# EAGLE design Tiny_UniProg (EAGLE 9.5.2)

## Sheet 1 of 2
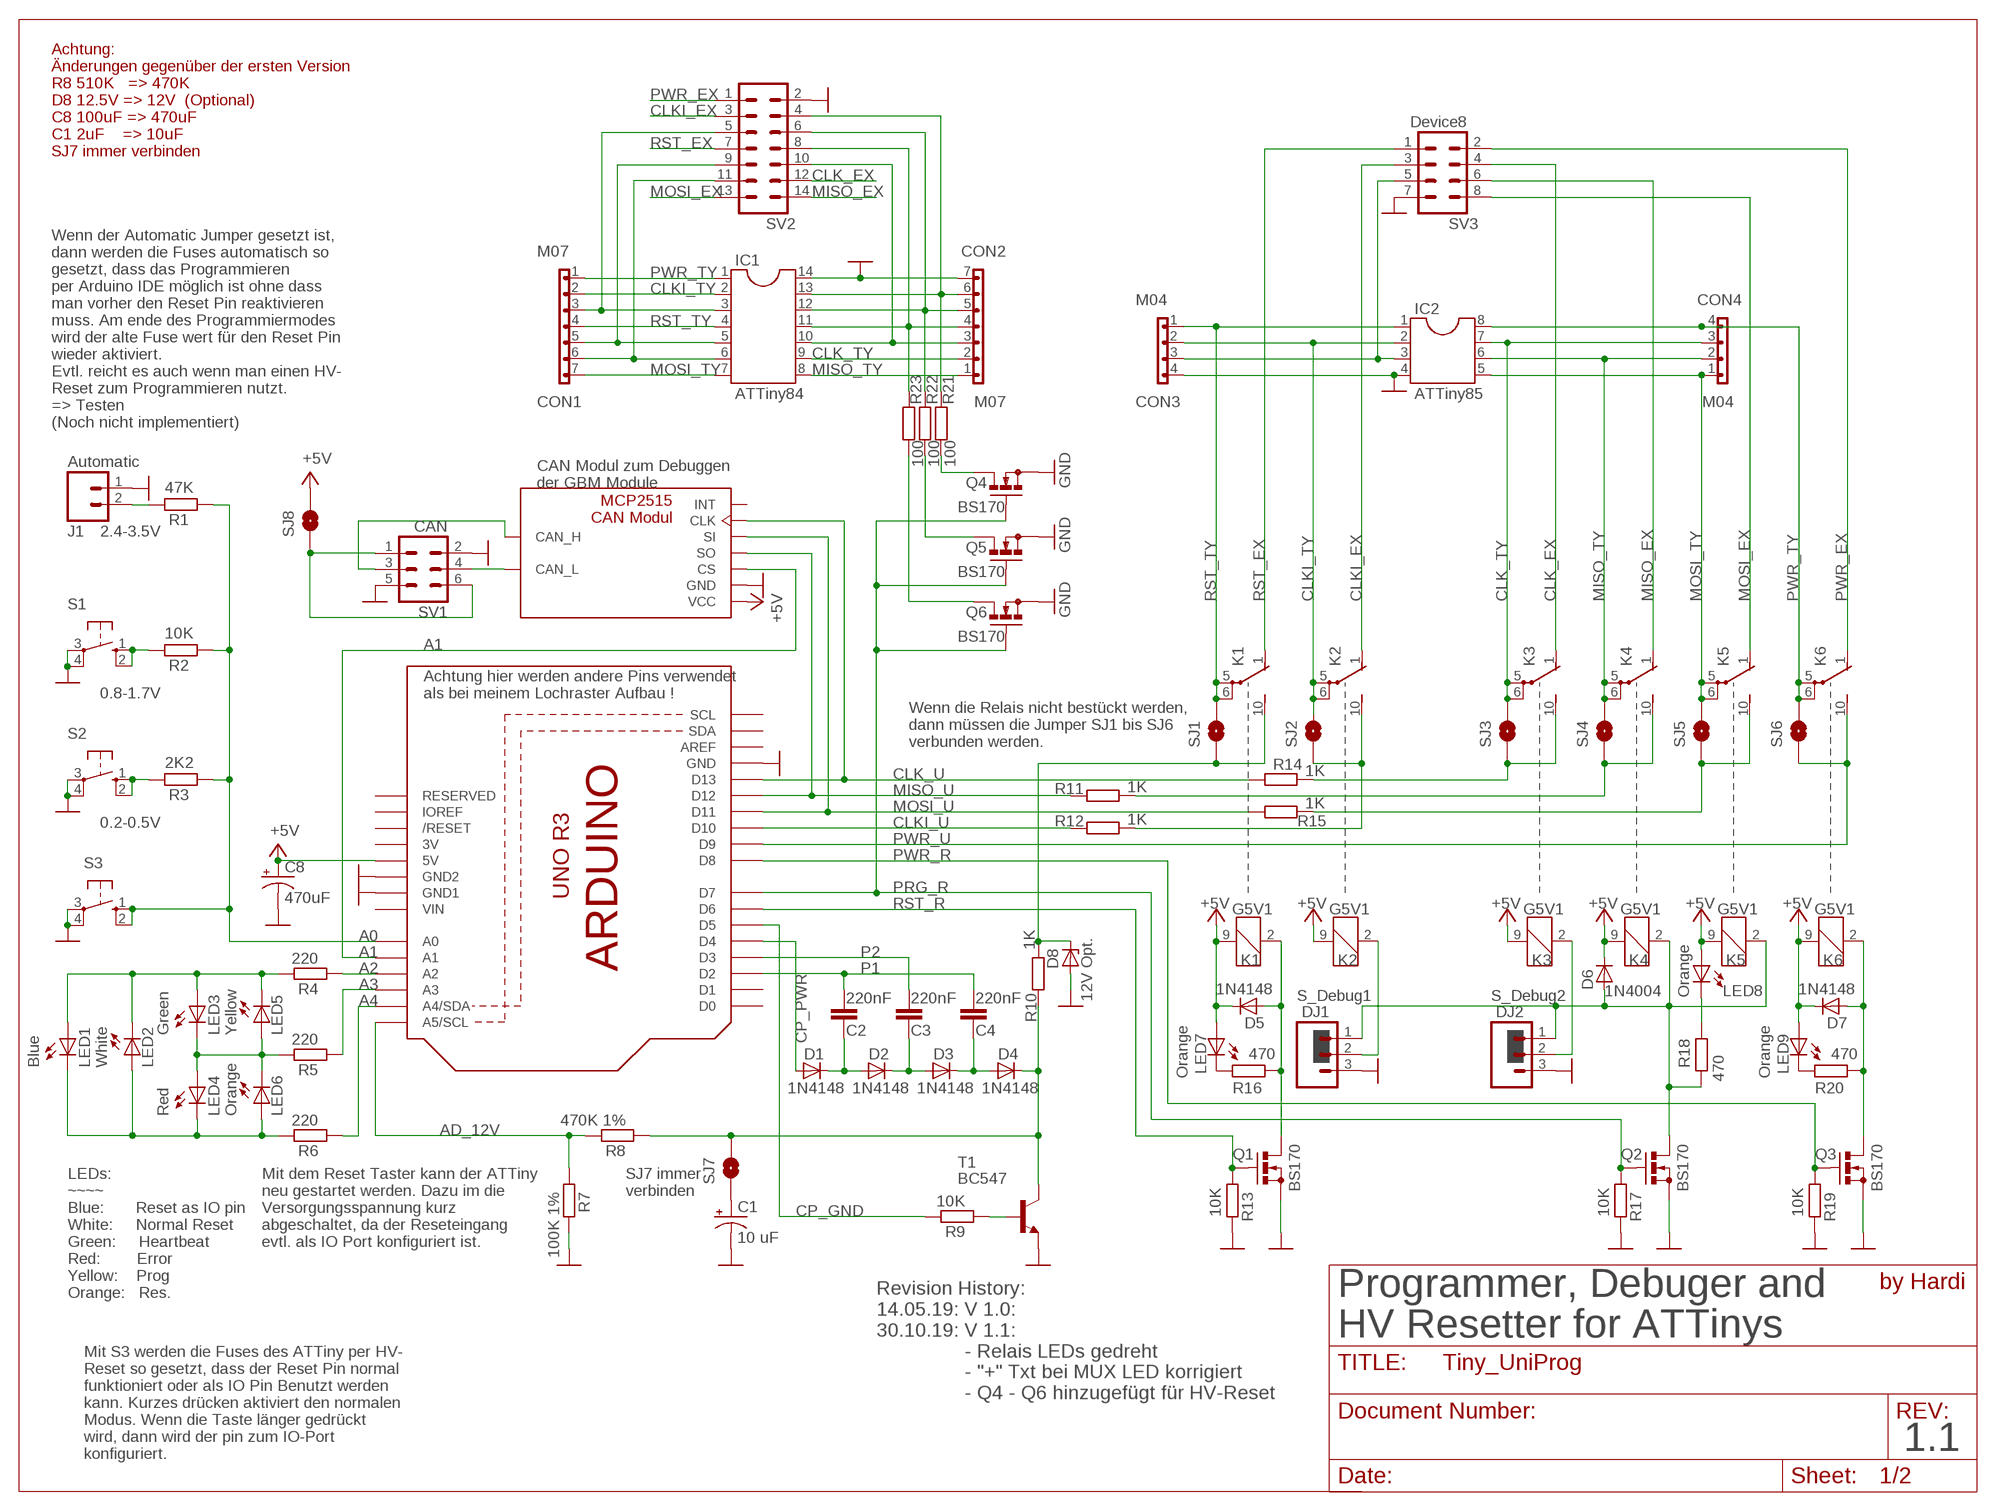
[diagram p0: schematic, sheet 1]

### Parts
C1  10 uF  100UF-25V-20%(PTH)D5MM  [CPOL-RADIAL-10UF-63V]
C2  220nF  C-EU050-024X044  [C050-024X044]
C3  220nF  C-EU050-024X044  [C050-024X044]
C4  220nF  C-EU050-024X044  [C050-024X044]
C8  470uF  SPARKFUN-CAPACITORS_100UF-25V-20%(PTH)  [SPARKFUN-CAPACITORS_CPOL-RADIAL-100UF-25V]
CAN1  MCP2515_CAN_MODUL  [MCP2515_CAN_MODUL]
CON1  M07  [1X07]
CON2  M07  [1X07]
CON3  M04  [1X04]
CON4  M04  [1X04]
D1  1N4148  1N4148DO35-2  [DO35-2]
D2  1N4148  1N4148DO35-2  [DO35-2]
D3  1N4148  1N4148DO35-2  [DO35-2]
D4  1N4148  1N4148DO35-2  [DO35-2]
D5  1N4148  1N4148DO35-2  [DO35-2]
D6  1N4004  1N4004DO35-2  [DO35-2]
D7  1N4148  1N4148DO35-2  [DO35-2]
D8  12V Opt.  ZENER-DIODEZD-2.5  [ZDIO-2.5]
DJ1  S_Debug1  M03PTH  [1X03]
DJ2  S_Debug2  M03PTH  [1X03]
IC1  ATTiny84  DIL14  [DIL14]
IC2  ATTiny85  DIL8  [DIL08]
J1  Automatic  M02PTH  [1X02]
K1  G5V1  [G5V1]
K2  G5V1  [G5V1]
K3  G5V1  [G5V1]
K4  G5V1  [G5V1]
K5  G5V1  [G5V1]
K6  G5V1  [G5V1]
LED1  Blue  LED3MM  [LED3MM]
LED2  White  LED3MM  [LED3MM]
LED3  Green  LED3MM  [LED3MM]
LED4  Red  LED3MM  [LED3MM]
LED5  Yellow  LED3MM  [LED3MM]
LED6  Orange  LED3MM  [LED3MM]
LED7  Orange  LED3MM  [LED3MM]
LED8  Orange  LED3MM  [LED3MM]
LED9  Orange  LED3MM  [LED3MM]
Q1  BS170  [SOT54E]
Q2  BS170  [SOT54E]
Q3  BS170  [SOT54E]
Q4  BS170  [SOT54E]
Q5  BS170  [SOT54E]
Q6  BS170  [SOT54E]
R1  47K  R0204/7  [0204/7]
R2  10K  R0204/7  [0204/7]
R3  2K2  R0204/2V  [0204/2V]
R4  220  R0204/2V  [0204/2V]
R5  220  R0204/2V  [0204/2V]
R6  220  R0204/2V  [0204/2V]
R7  100K 1%  R0204/2V  [0204/2V]
R8  470K 1%  R0204/7  [0204/7]
R9  10K  R0204/2V  [0204/2V]
R10  1K  R0204/2V  [0204/2V]
R11  1K  R0204/2V  [0204/2V]
R12  1K  R0204/2V  [0204/2V]
R13  10K  R0204/2V  [0204/2V]
R14  1K  R0204/2V  [0204/2V]
R15  1K  R0204/2V  [0204/2V]
R16  470  R0204/2V  [0204/2V]
R17  10K  R0204/2V  [0204/2V]
R18  470  R0204/2V  [0204/2V]
R19  10K  R0204/2V  [0204/2V]
R20  470  R0204/2V  [0204/2V]
R21  100  R0204/2V  [0204/2V]
R22  100  R0204/2V  [0204/2V]
R23  100  R0204/2V  [0204/2V]
S1  10-XX  [B3F-10XX]
S2  10-XX  [B3F-10XX]
S3  10-XX  [B3F-10XX]
SJ1  SOLDERJUMPERNO  [SJ_2S-NO]
SJ2  SOLDERJUMPERNO  [SJ_2S-NO]
SJ3  SOLDERJUMPERNO  [SJ_2S-NO]
SJ4  SOLDERJUMPERNO  [SJ_2S-NO]
SJ5  SOLDERJUMPERNO  [SJ_2S-NO]
SJ6  SOLDERJUMPERNO  [SJ_2S-NO]
SJ7  SOLDERJUMPERNO  [SJ_2S-NO]
SJ8  SOLDERJUMPERNO  [SJ_2S-NO]
SV1  CAN  ML6  [ML6]
SV2  ML14  [ML14]
SV3  Device8  CON-HARTING-ML_ML08  [CON-HARTING-ML_ML08]
T1  BC547  [TO92]
U1  ARDUINOR3-DIMENSION  [ARDUINOR3]

### Nets
+5V: C8.1(+) CAN1.1(VCC) D5.C D6.C D7.C K1.9 K2.9 K3.9 K4.9 K5.9 K6.9 LED7.A LED8.A LED9.A SJ8.2 U1.5V
A0: R1.1 R2.1 R3.1 S3.1(S) S3.2(S1) U1.A0
A1: CAN1.3(CS) U1.A1
A2: R4.1 U1.A2
A3: R5.1 U1.A3
A4: R6.1 U1.A4(A4/SDA)
AD_12V: R7.1 R8.2 U1.A5(A5/SCL)
CLK_EX: K3.1(2:O) SV2.12 SV3.4
CLK_TY: CON2.2 CON4.3 IC1.9 IC2.7 K3.5(2:P) K3.6(2:P) SJ3.2
CLK_U: CAN1.6(CLK) R14.1 U1.D13
CLKI_EX: K2.1(2:O) SV2.3 SV3.3
CLKI_TY: CON1.2 CON3.2 IC1.2 IC2.2 K2.5(2:P) K2.6(2:P) SJ2.2
CLKI_U: R12.1 U1.D10
CP_GND: R9.2 U1.D5
CP_PWR: D1.A U1.D4
GND: C1.2(-) C8.2(-) CAN1.2(GND) CON2.7 CON3.4 D8.A DJ1.3 DJ2.3 IC1.14 IC2.4 J1.1 Q1.S Q2.S Q3.S Q4.S Q5.S Q6.S R7.2 R13.2 R17.2 R19.2 S1.3(P) S1.4(P1) S2.3(P) S2.4(P1) S3.3(P) S3.4(P1) SV1.2 SV1.5 SV2.2 SV3.7 T1.1(E) U1.GND U1.GND1 U1.GND2
MISO_EX: K4.1(2:O) SV2.14 SV3.6
MISO_TY: CON2.1 CON4.2 IC1.8 IC2.6 K4.5(2:P) K4.6(2:P) SJ4.2
MISO_U: CAN1.4(SO) R11.1 U1.D12
MOSI_EX: K5.1(2:O) SV2.13 SV3.8
MOSI_TY: CON1.7 CON4.1 IC1.7 IC2.5 K5.5(2:P) K5.6(2:P) SJ5.2
MOSI_U: CAN1.5(SI) R15.1 U1.D11
N$1: C2.2 D1.C D2.A
N$2: C3.2 D2.C D3.A
N$3: C4.2 D3.C D4.A
N$6: CON2.3 IC1.10 SV2.10
N$7: R9.1 T1.2(B)
N$8: CAN1.8(CAN_L) SV1.4
N$9: D4.C R8.1 R10.2 SJ7.2 T1.3(C)
N$10: CAN1.9(CAN_H) SV1.3
N$11: CON2.4 IC1.11 R23.2 SV2.8
N$12: CON2.5 IC1.12 R22.2 SV2.6
N$13: K5.10(2:S) R15.2 SJ5.1
N$14: CON2.6 IC1.13 R21.2 SV2.4
N$15: K4.10(2:S) R11.2 SJ4.1
N$17: K3.10(2:S) R14.2 SJ3.1
N$19: DJ1.2 K2.2
N$20: D5.A K1.2 Q1.D R16.2
N$21: DJ2.2 K3.2
N$22: D8.C K1.10(2:S) R10.1 SJ1.1
N$23: CON1.6 IC1.6 SV2.11
N$24: K2.10(2:S) R12.2 SJ2.1
N$25: D7.A K6.2 Q3.D R20.2
N$26: D6.A DJ1.1 DJ2.1 K4.2 K5.2 Q2.D R18.2
N$27: CON1.5 IC1.5 SV2.9
N$28: J1.2 R1.2
N$30: CON1.3 IC1.3 SV2.5
N$33: R3.2 S2.1(S) S2.2(S1)
N$34: LED1.A LED2.K(C) LED3.A LED5.K(C) R4.2
N$36: LED7.K(C) R16.1
N$37: LED8.K(C) R18.1
N$38: LED9.K(C) R20.1
N$39: C1.1(+) SJ7.1
N$42: LED3.K(C) LED4.A LED5.A LED6.K(C) R5.2
N$44: LED1.K(C) LED2.A LED4.K(C) LED6.A R6.2
N$45: SJ8.1 SV1.1 SV1.6
N$48: CON3.3 IC2.3 SV3.5
N$67: R2.2 S1.1(S) S1.2(S1)
N$108: Q4.D R21.1
N$109: Q5.D R22.1
N$110: Q6.D R23.1
P1: C2.1 C4.1 U1.D2
P2: C3.1 U1.D3
PRG_R: Q2.G Q4.G Q5.G Q6.G R17.1 U1.D7
PWR_EX: K6.1(2:O) SV2.1 SV3.2
PWR_R: Q3.G R19.1 U1.D8
PWR_TY: CON1.1 CON4.4 IC1.1 IC2.8 K6.5(2:P) K6.6(2:P) SJ6.2
PWR_U: K6.10(2:S) SJ6.1 U1.D9
RST_EX: K1.1(2:O) SV2.7 SV3.1
RST_R: Q1.G R13.1 U1.D6
RST_TY: CON1.4 CON3.1 IC1.4 IC2.1 K1.5(2:P) K1.6(2:P) SJ1.2
Unconnected: CAN1.7(INT) U1.AREF U1.D0 U1.D1 U1.IOREF U1.RESERVED U1.RESET(/RESET) U1.SCL U1.SDA

### Notes on the sheet
- Achtung:
  Änderungen gegenüber der ersten Version
  R8 510K   => 470K
  D8 12.5V => 12V  (Optional)
  C8 100uF => 470uF
  C1 2uF    => 10uF
  SJ7 immer verbinden
- Wenn der Automatic Jumper gesetzt ist,
  dann werden die Fuses automatisch so
  gesetzt, dass das Programmieren
  per Arduino IDE möglich ist ohne dass
  man vorher den Reset Pin reaktivieren
  muss. Am ende des Programmiermodes
  wird der alte Fuse wert für den Reset Pin
  wieder aktiviert.
  Evtl. reicht es auch wenn man einen HV-
  Reset zum Programmieren nutzt.
  => Testen
  (Noch nicht implementiert)
- CAN Modul zum Debuggen 
  der GBM Module
- 2.4-3.5V
- 0.8-1.7V
- Achtung hier werden andere Pins verwendet
  als bei meinem Lochraster Aufbau !
- Wenn die Relais nicht bestückt werden,
  dann müssen die Jumper SJ1 bis SJ6
  verbunden werden.
- 0.2-0.5V
- LEDs:
  ~~~~
  Blue:       Reset as IO pin
  White:     Normal Reset
  Green:     Heartbeat
  Red:        Error
  Yellow:    Prog
  Orange:   Res.
- Mit dem Reset Taster kann der ATTiny
  neu gestartet werden. Dazu im die
  Versorgungsspannung kurz
  abgeschaltet, da der Reseteingang
  evtl. als IO Port konfiguriert ist.
- SJ7 immer
  verbinden
- Revision History:
  14.05.19: V 1.0: 
  30.10.19: V 1.1: 
                  - Relais LEDs gedreht 
                  - "+" Txt bei MUX LED korrigiert
                  - Q4 - Q6 hinzugefügt für HV-Reset
- by Hardi
- Programmer, Debuger and 
  HV Resetter for ATTinys
- Mit S3 werden die Fuses des ATTiny per HV-
  Reset so gesetzt, dass der Reset Pin normal
  funktioniert oder als IO Pin Benutzt werden
  kann. Kurzes drücken aktiviert den normalen
  Modus. Wenn die Taste länger gedrückt
  wird, dann wird der pin zum IO-Port 
  konfiguriert.
- 1.1

## Sheet 2 of 2
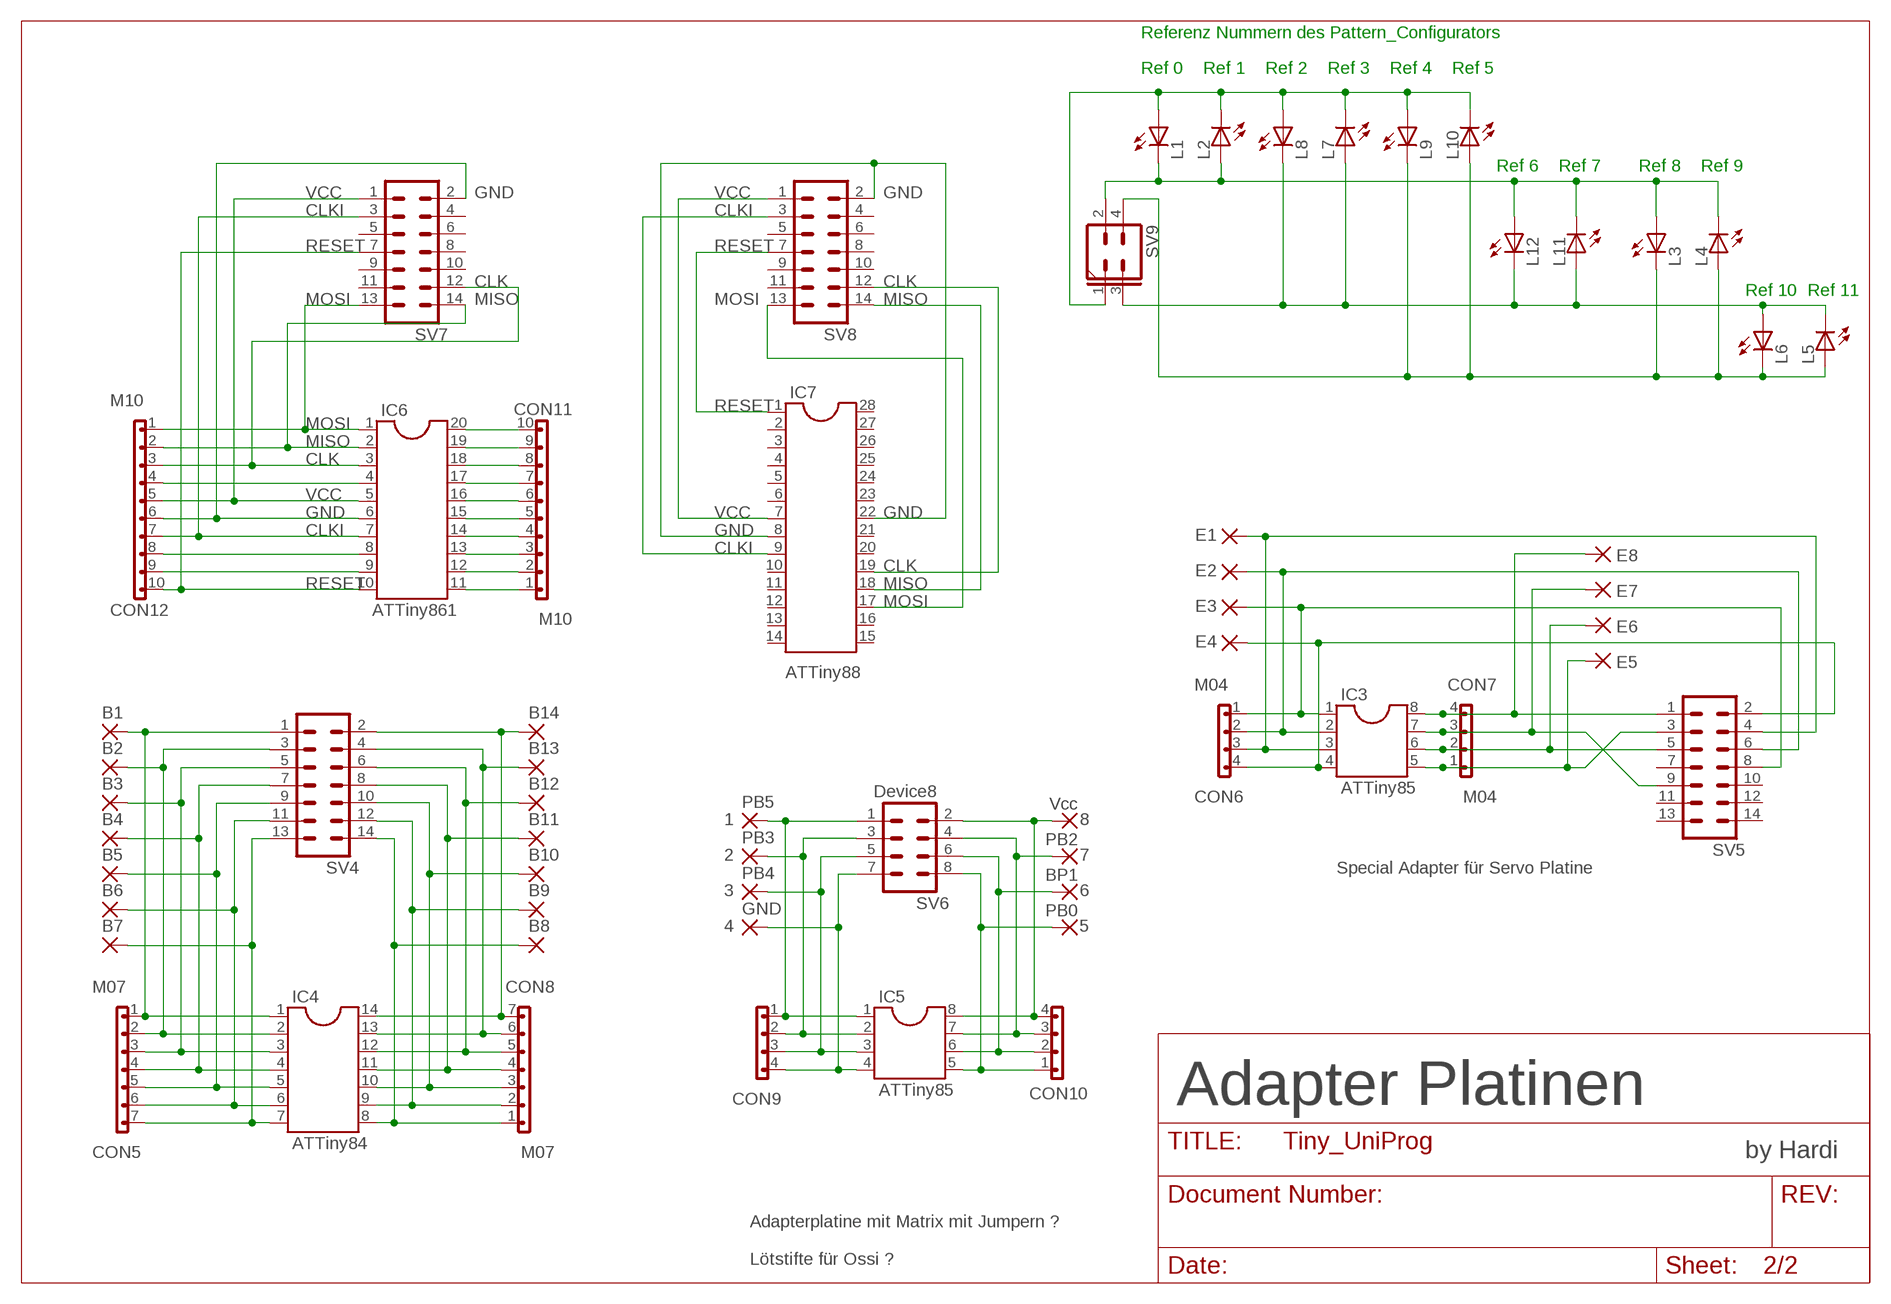
[diagram p1: schematic, sheet 2]

### Parts
1  PB5  2,54/1,0  [2,54/1,0]
2  PB3  2,54/1,0  [2,54/1,0]
3  PB4  2,54/1,0  [2,54/1,0]
4  GND  2,54/1,0  [2,54/1,0]
5  PB0  2,54/1,0  [2,54/1,0]
6  BP1  2,54/1,0  [2,54/1,0]
7  PB2  2,54/1,0  [2,54/1,0]
8  Vcc  2,54/1,0  [2,54/1,0]
B1  2,54/1,0  [2,54/1,0]
B2  2,54/1,0  [2,54/1,0]
B3  2,54/1,0  [2,54/1,0]
B4  2,54/1,0  [2,54/1,0]
B5  2,54/1,0  [2,54/1,0]
B6  2,54/1,0  [2,54/1,0]
B7  2,54/1,0  [2,54/1,0]
B8  2,54/1,0  [2,54/1,0]
B9  2,54/1,0  [2,54/1,0]
B10  2,54/1,0  [2,54/1,0]
B11  2,54/1,0  [2,54/1,0]
B12  2,54/1,0  [2,54/1,0]
B13  2,54/1,0  [2,54/1,0]
B14  2,54/1,0  [2,54/1,0]
CON5  M07  [1X07]
CON6  M04  [1X04]
CON7  M04  [1X04]
CON8  M07  [1X07]
CON9  M04  [1X04]
CON10  M04  [1X04]
CON11  M10  [1X10]
CON12  M10  [1X10]
E1  2,54/1,0  [2,54/1,0]
E2  2,54/1,0  [2,54/1,0]
E3  2,54/1,0  [2,54/1,0]
E4  2,54/1,0  [2,54/1,0]
E5  2,54/1,0  [2,54/1,0]
E6  2,54/1,0  [2,54/1,0]
E7  2,54/1,0  [2,54/1,0]
E8  2,54/1,0  [2,54/1,0]
IC3  ATTiny85  DIL8  [DIL08]
IC4  ATTiny84  DIL14  [DIL14]
IC5  ATTiny85  DIL8  [DIL08]
IC6  ATTiny861  DIL20  [DIL20]
IC7  DIL28-3  [DIL28-3]
L1  LED3MM  [LED3MM]
L2  LED3MM  [LED3MM]
L3  LED3MM  [LED3MM]
L4  LED3MM  [LED3MM]
L5  LED3MM  [LED3MM]
L6  LED3MM  [LED3MM]
L7  LED3MM  [LED3MM]
L8  LED3MM  [LED3MM]
L9  LED3MM  [LED3MM]
L10  LED3MM  [LED3MM]
L11  LED3MM  [LED3MM]
L12  LED3MM  [LED3MM]
SV4  ML14  [ML14]
SV5  ML14  [ML14]
SV6  Device8  CON-HARTING-ML_ML08  [CON-HARTING-ML_ML08]
SV7  ML14  [ML14]
SV8  ML14  [ML14]
SV9  MA02-2MUX-SIGNAL  [MUX-SIGNAL]

### Nets
N$4: 4.1(P) CON9.4 IC5.4 SV6.7
N$5: 3.1(P) CON9.3 IC5.3 SV6.5
N$16: 2.1(P) CON9.2 IC5.2 SV6.3
N$18: 1.1(P) CON9.1 IC5.1 SV6.1
N$29: 5.1(P) CON10.1 IC5.5 SV6.8
N$31: 6.1(P) CON10.2 IC5.6 SV6.6
N$32: 7.1(P) CON10.3 IC5.7 SV6.4
N$35: B8.1(P) CON8.1 IC4.8 SV4.14
N$40: B9.1(P) CON8.2 IC4.9 SV4.12
N$41: B10.1(P) CON8.3 IC4.10 SV4.10
N$43: B11.1(P) CON8.4 IC4.11 SV4.8
N$46: B12.1(P) CON8.5 IC4.12 SV4.6
N$47: B13.1(P) CON8.6 IC4.13 SV4.4
N$49: B14.1(P) CON8.7 IC4.14 SV4.2
N$50: B7.1(P) CON5.7 IC4.7 SV4.13
N$51: B6.1(P) CON5.6 IC4.6 SV4.11
N$52: B5.1(P) CON5.5 IC4.5 SV4.9
N$53: B4.1(P) CON5.4 IC4.4 SV4.7
N$54: B3.1(P) CON5.3 IC4.3 SV4.5
N$55: B2.1(P) CON5.2 IC4.2 SV4.3
N$56: B1.1(P) CON5.1 IC4.1 SV4.1
N$57: 8.1(P) CON10.4 IC5.8 SV6.2
N$58: CON7.4 E8.1(P) IC3.8 SV5.1
N$59: CON6.4 E4.1(P) IC3.4 SV5.2
N$60: CON7.3 E7.1(P) IC3.7 SV5.9
N$61: CON7.2 E6.1(P) IC3.6 SV5.5
N$62: CON7.1 E5.1(P) IC3.5 SV5.3
N$63: CON6.1 E3.1(P) IC3.1 SV5.8
N$64: CON6.2 E2.1(P) IC3.2 SV5.6
N$65: CON6.3 E1.1(P) IC3.3 SV5.4
N$66: CON12.10 IC6.10 SV7.7
N$68: CON12.7 IC6.7 SV7.3
N$69: CON12.6 IC6.6 SV7.2
N$70: CON12.5 IC6.5 SV7.1
N$71: CON12.3 IC6.3 SV7.12
N$72: CON12.2 IC6.2 SV7.14
N$73: CON12.1 IC6.1 SV7.13
N$74: CON12.4 IC6.4
N$75: CON12.8 IC6.8
N$76: CON12.9 IC6.9
N$77: CON11.1 IC6.11
N$78: CON11.2 IC6.12
N$79: CON11.3 IC6.13
N$80: CON11.4 IC6.14
N$81: CON11.5 IC6.15
N$82: CON11.6 IC6.16
N$83: CON11.7 IC6.17
N$84: CON11.8 IC6.18
N$85: CON11.9 IC6.19
N$86: CON11.10 IC6.20
N$87: IC7.9 SV8.3
N$88: IC7.8 IC7.22 SV8.2
N$89: IC7.7 SV8.1
N$90: IC7.1 SV8.7
N$91: IC7.17 SV8.13
N$92: IC7.18 SV8.14
N$93: L1.K(C) L2.A L3.A L4.K(C) L11.K(C) L12.A SV9.2
N$94: IC7.19 SV8.12
N$95: L1.A L2.K(C) L7.K(C) L8.A L9.A L10.K(C) SV9.1
N$97: L3.K(C) L4.A L5.A L6.K(C) L9.K(C) L10.A SV9.4
N$98: L5.K(C) L6.A L7.A L8.K(C) L11.A L12.K(C) SV9.3
Unconnected: IC7.2 IC7.3 IC7.4 IC7.5 IC7.6 IC7.10 IC7.11 IC7.12 IC7.13 IC7.14 IC7.15 IC7.16 IC7.20 IC7.21 IC7.23 IC7.24 IC7.25 IC7.26 IC7.27 IC7.28 SV5.7 SV5.10 SV5.11 SV5.12 SV5.13 SV5.14 SV7.4 SV7.5 SV7.6 SV7.8 SV7.9 SV7.10 SV7.11 SV8.4 SV8.5 SV8.6 SV8.8 SV8.9 SV8.10 SV8.11

### Notes on the sheet
- Referenz Nummern des Pattern_Configurators
- Ref 0 | Ref 1 | Ref 2 | Ref 3 | Ref 4 | Ref 5
- Ref 6 | Ref 7 | Ref 8 | Ref 9
- VCC | GND | VCC | GND
- CLKI | CLKI
- RESET | RESET
- CLK | CLK
- Ref 10 | Ref 11
- MOSI | MISO | MOSI | MISO
- RESET
- MOSI
- MISO
- CLK
- VCC
- GND | VCC | GND
- CLKI | GND
- CLKI
- CLK
- RESET | MISO
- MOSI
- ATTiny88
- Special Adapter für Servo Platine
- Adapter Platinen
- by Hardi
- Adapterplatine mit Matrix mit Jumpern ?
  
  Lötstifte für Ossi ?

## Power pins joined to a net without a drawn wire
3V: U1.3V
VIN: U1.VIN

## Library data of the parts
1-8 B1-B14 E1-E8 = wirepad:2,54/1,0: THROUGH-HOLE PAD
C1 = SparkFun-Capacitors:100UF-25V-20%(PTH): CAP-08439
C2-C4 = rcl:C-EU: CAPACITOR, European symbol; SPICEPREFIX: C
C8 = Sound_MP3-TF-16P_and_WS2811:SPARKFUN-CAPACITORS_100UF-25V-20%(PTH): CAP-08439; PROD_ID: CAP-08439
CAN1 = Arduino_fuer_LEDs_DCC_2_All:MCP2515_CAN_MODUL: MCP2515 CAN Modul
CON1 CON2 CON5 CON8 = Connectors_Inline3_7:M07
CON3 CON4 CON6 CON7 CON9 CON10 = Connectors_Inline3_7:M04
CON11 CON12 = Connectors_Inline3_7:M10
D1-D5 D7 = diode:1N4148: DIODE high speed (Philips)
D6 = diode:1N4004: DIODE general purpose rectifier, 1 A
D8 = diode:ZENER-DIODE: Z-Diode
DJ1 DJ2 = SparkFun-Connectors:M03: Header 3 Standard 3-pin 0.1" header. Use with straight break away headers (SKU : PRT-00116), right angle break away headers (PRT-00553), swiss pins (PRT-00743), machine pins (PRT-00117), and female headers (PRT-00115). Molex polarized connector foot print use with SKU : PRT-08232 with associated crimp pins and housings.
IC1 IC4 = ic-package:DIL14: Dual In Line / Socket
IC2 IC3 IC5 = ic-package:DIL8: Dual In Line / Socket
IC6 = ic-package:DIL20: Dual In Line / Socket
IC7 = ic-package:DIL28: Dual In Line
J1 = SparkFun-Connectors:M02: Standard 2-pin 0.1" header. Use with - straight break away headers ( PRT-00116) - right angle break away headers (PRT-00553) - swiss pins (PRT-00743) - machine pins (PRT-00117) - female headers (PRT-00115) Molex polarized connector foot print use with: PRT-08233 with associated crimp pins and housings. 2.54_SCREWTERM for use with PRT-10571. 3.5mm Screw Terminal footprints for PRT-08084 5mm Screw Terminal footprints for use with PRT-08432
K1-K6 = relay:G5V1: RELAY 1 x switch, 0.5 A/125 V AC, 1 A/24 V DC , Omron; MPN: G5V-1-DC24; OC_FARNELL: 9949593; OC_NEWARK: 36M6377
L1-L12 LED1-LED9 = Arduino_fuer_LEDs_DCC_2:LED: LED OSRAM: - CHIPLED LG R971, LG N971, LY N971, LG Q971, LY Q971, LO R971, LY R971 LH N974, LH R974 LS Q976, LO Q976, LY Q976 LO Q996 - Hyper CHIPLED LW Q18S LB Q993, LB Q99A, LB R99A - SideLED LS A670, LO A670, LY A670, LG A670, LP A670 LB A673, LV A673, LT A673, LW A673 LH A674 LY A675 LS A676, LA A676, LO A676, LY A676, LW A676 LS A679, LY A679, LG A679 - Hyper Micro SIDELED® LS Y876, LA Y876, LO Y876, LY Y876 LT Y87S - SmartLED LW L88C, LW L88S LB L89C, LB L89S, LG L890 LS L89K, LO L89K, LY L89K LS L896, LA L896, LO L896, LY L896 - TOPLED LS T670, LO T670, LY T670, LG T670, LP T670 LSG T670, LSP T670, LSY T670, LOP T670, LYG T670 LG T671, LOG T671, LSG T671 LB T673, LV T673, LT T673, LW T673 LH T674 LS T676, LA T676, LO T676, LY T676, LB T676, LH T676, LSB T676, LW T676 LB T67C, LV T67C, LT T67C, LS T67K, LO T67K, LY T67K, LW E67C LS E67B, LA E67B, LO E67B, LY E67B, LB E67C, LV E67C, LT E67C LW T67C LS T679, LY T679, LG T679 LS T770, LO T770, LY T770, LG T770, LP T770 LB T773, LV T773, LT T773, LW T773 LH T774 LS E675, LA E675, LY E675, LS T675 LS T776, LA T776, LO T776, LY T776, LB T776 LHGB T686 LT T68C, LB T68C - Hyper Mini TOPLED® LB M676 - Mini TOPLED Santana® LG M470 LS M47K, LO M47K, LY M47K Source: http://www.osram.convergy.de LUXEON: - LUMILED® LXK2-PW12-R00, LXK2-PW12-S00, LXK2-PW14-U00, LXK2-PW14-V00 LXK2-PM12-R00, LXK2-PM12-S00, LXK2-PM14-U00 LXK2-PE12-Q00, LXK2-PE12-R00, LXK2-PE12-S00, LXK2-PE14-T00, LXK2-PE14-U00 LXK2-PB12-K00, LXK2-PB12-L00, LXK2-PB12-M00, LXK2-PB14-N00, LXK2-PB14-P00, LXK2-PB14-Q00 LXK2-PR12-L00, LXK2-PR12-M00, LXK2-PR14-Q00, LXK2-PR14-R00 LXK2-PD12-Q00, LXK2-PD12-R00, LXK2-PD12-S00 LXK2-PH12-R00, LXK2-PH12-S00 LXK2-PL12-P00, LXK2-PL12-Q00, LXK2-PL12-R00 Source: www.luxeon.com KINGBRIGHT: KA-3528ASYC Source: www.kingbright.com
Q1-Q6 = transistor-small-signal:BS170: N-CHANNEL MOS FET
R1 R2 R8 = Arduino_fuer_LEDs_DCC_2:R: RESISTOR, European symbol; SPICEMODEL: NONE; SPICEPREFIX: R
R3-R7 R9-R23 = Arduino_fuer_LEDs_DCC_2:R: RESISTOR, European symbol
S1-S3 = switch-omron:10-XX: OMRON SWITCH; MPN: B3F-1000; OC_FARNELL: 176432; OC_NEWARK: 36M3542
SJ1-SJ8 = SparkFun-Retired:SOLDERJUMPER: Solder Jumper Standard SMD solder jumper. Used to automate production. Two varients : Normally Open and Normally Closed are the same, but have different paste layers. NC will have a large amount of paste and should jumper during reflow.
SV1 = Arduino_fuer_LEDs_DCC_2:ML6: HARTING; OC_FARNELL: unknown; OC_NEWARK: unknown
SV2 SV4 SV5 SV7 SV8 = Arduino_fuer_LEDs_DCC_2:ML14: HARTING; OC_FARNELL: unknown; OC_NEWARK: unknown
SV3 SV6 = PushButtonAction_4017_2:CON-HARTING-ML_ML08: Modified by Hardi; OC_FARNELL: unknown; OC_NEWARK: unknown
SV9 = con-lstb:MA02-2: PIN HEADER
T1 = transistor:BC547: NPN TRANSISTOR
U1 = adafruit:ARDUINOR3: This is a new object for the new Arduino R3 - with extra pins that you may want to use (such as IOref, and duplicated A4/A5

## Board
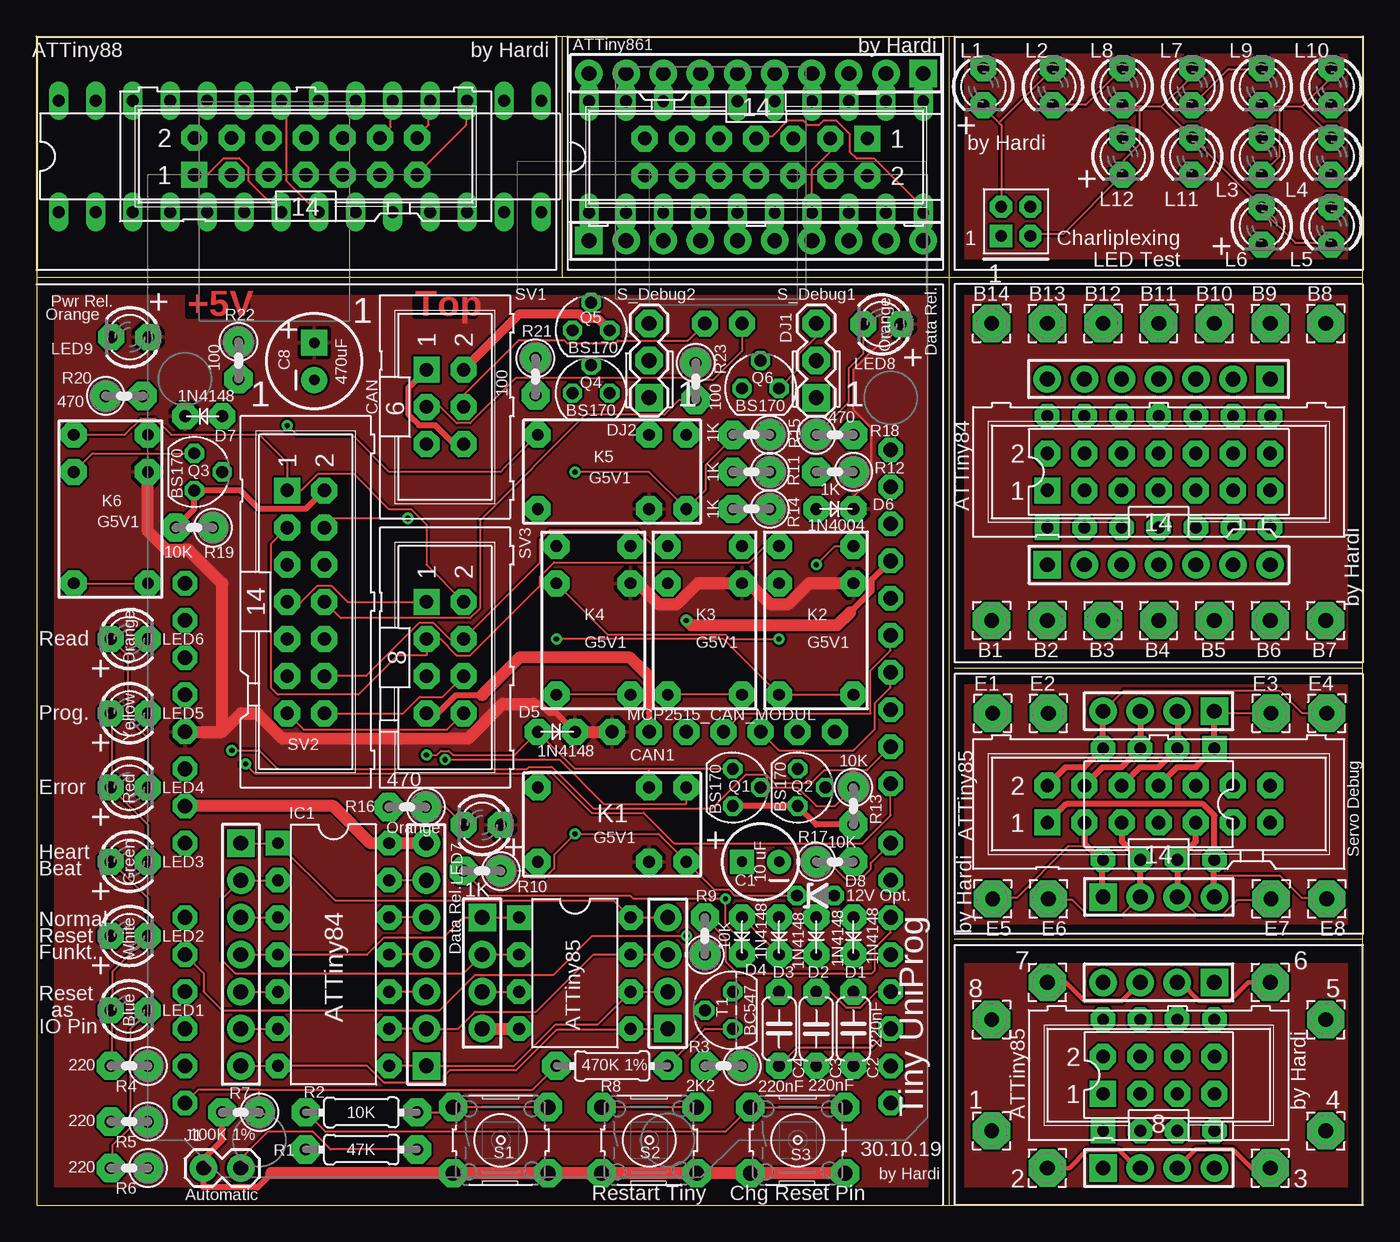
[diagram p2: board, top side]
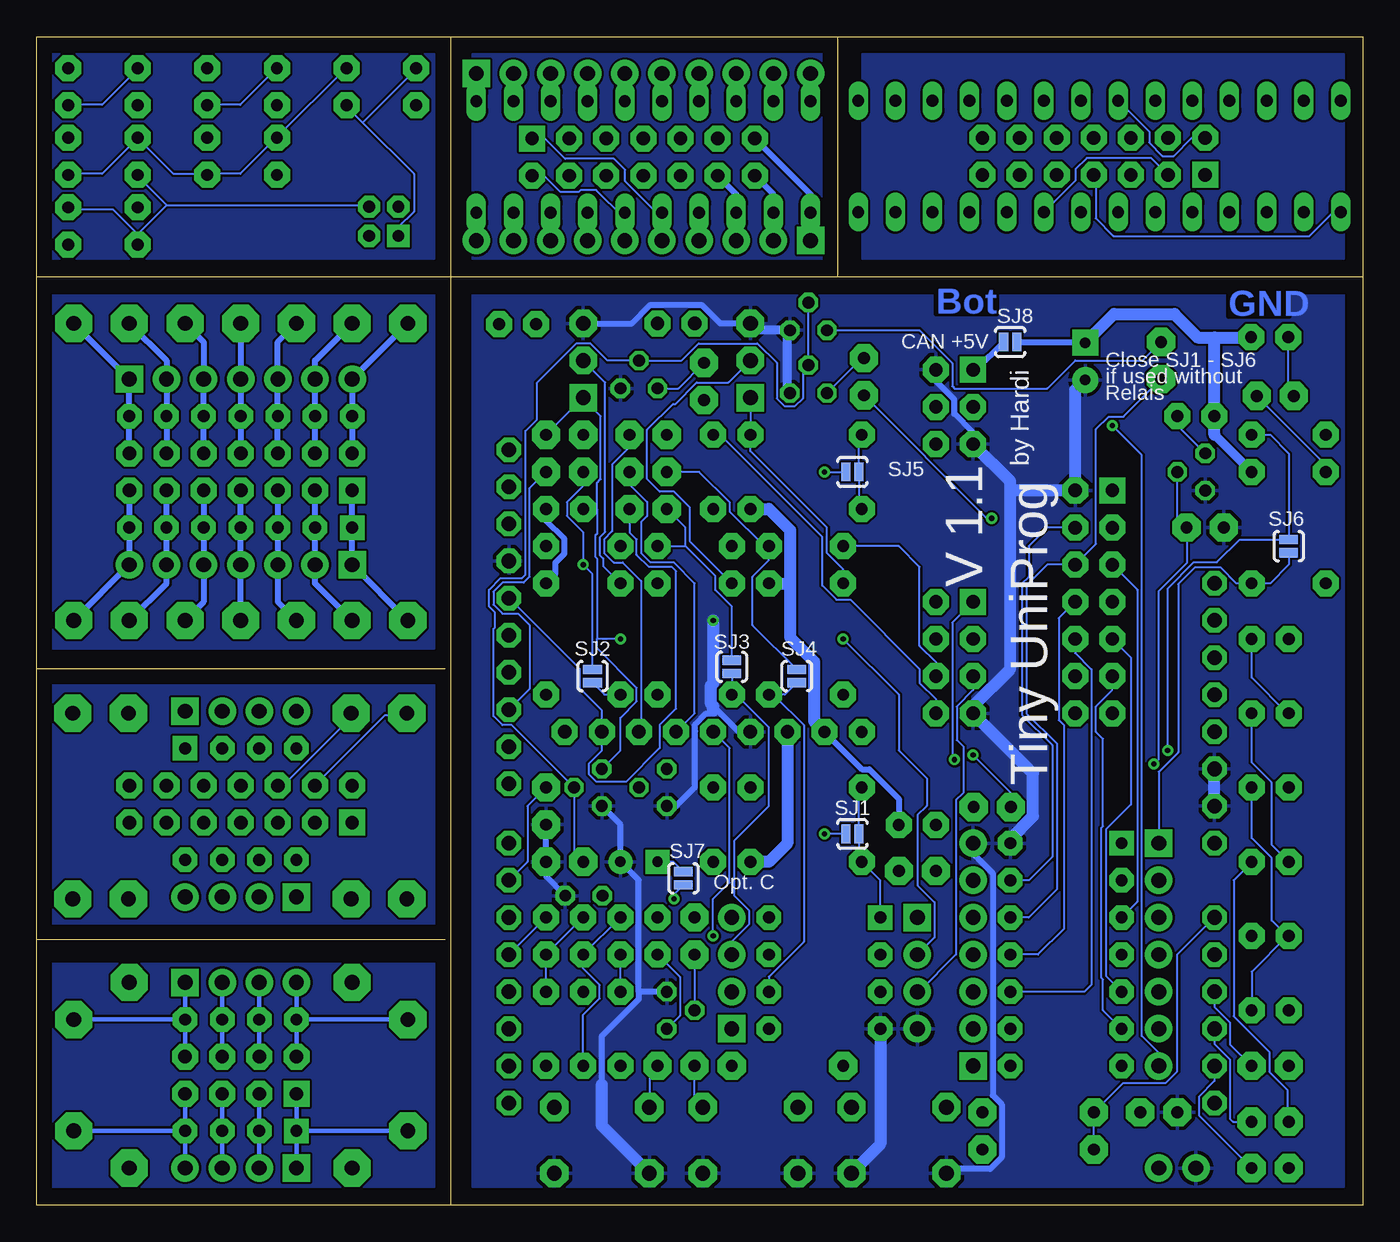
[diagram p3: board, bottom side, seen from below]

Size 90.74 x 79.95 mm. Coordinates in mm from the lower left corner, seen from the top.
Outline: 62.4,0 90.74,0 90.74,36.73
Outline: 90.74,36.73 90.74,63.5
Outline: 90.74,63.5 90.74,79.95 62.4,79.95
Outline: 0,63.5 0,79.95 62.4,79.95
Outline: 0,63.5 0,0 62.4,0
Outline: 0,63.5 35.96,63.5
Outline: 35.96,63.5 90.74,63.5
Outline: 62.4,79.95 62.4,0
Outline: 90.74,18.18 62.8,18.18
Outline: 90.74,36.73 62.8,36.73
Outline: 35.96,79.9 35.96,63.5
Copper layers (1*16): Top 0.035mm / dielectric 1.5mm / Bottom 0.035mm
Design rules "default": minimum track width 6mil, minimum drill 0.35mm, track to track 6mil, track to pad 6mil, pad to pad 6mil, via to via 6mil, smd to smd 6mil, copper to edge 40mil, drill to drill 6mil, minimum pad ring 10mil, minimum via ring 8mil, stop-mask expansion 4mil, vias tented up to drill 0mil, thermal gap 10mil

### Footprints (pad centres in the part's own frame; a part is rotated, then mirrored left to right if it is on the bottom)
2,54/1,0 = drill 1.016 pad 2.54 octagon: 1 0,0
CPOL-RADIAL-10UF-63V = drill 0.7 pad 1.651 square: 1 1.27,0 | drill 0.7 pad 1.651: 2 -1.27,0
C050-024X044 = drill 0.813 pad 1.778 octagon: 1 -2.54,0; 2 2.54,0
SPARKFUN-CAPACITORS_CPOL-RADIAL-100UF-25V = drill 0.7 pad 1.778 square: 1 1.27,0 | drill 0.7 pad 1.778: 2 -1.27,0
MCP2515_CAN_MODUL = drill 0.914 pad 1.778 octagon: 1 0,0; 2 0,-2.54; 3 0,-5.08; 4 0,-7.62; 5 0,-10.16; 6 0,-12.7; 7 0,-15.24; 8 27.94,-6.35; 9 27.94,-8.89
1X07 = drill 1.016 pad 1.88 square: 1 0,0 | drill 1.016 pad 1.88: 2 2.54,0; 3 5.08,0; 4 7.62,0; 5 10.16,0; 6 12.7,0; 7 15.24,0
1X04 = drill 1.016 pad 1.88 square: 1 0,0 | drill 1.016 pad 1.88: 2 2.54,0; 3 5.08,0; 4 7.62,0
1X10 = drill 1.016 pad 1.88 square: 1 0,0 | drill 1.016 pad 1.88: 2 2.54,0; 3 5.08,0; 4 7.62,0; 5 10.16,0; 6 12.7,0; 7 15.24,0; 8 17.78,0; 9 20.32,0; 10 22.86,0
DO35-2 = drill 0.813 pad 1.778 octagon: A 1.27,0; C -1.27,0
ZDIO-2.5 = drill 0.813 octagon: A 1.27,0; C -1.27,0
1X03 = drill 1.016 pad 1.88 square: 1 0,0 | drill 1.016 pad 1.88 octagon: 2 2.54,0; 3 5.08,0
DIL14 = drill 0.813 pad 1.676 square: 1 -7.62,-3.81 | drill 0.813 pad 1.676 octagon: 2 -5.08,-3.81; 3 -2.54,-3.81; 4 0,-3.81; 5 2.54,-3.81; 6 5.08,-3.81; 7 7.62,-3.81; 8 7.62,3.81; 9 5.08,3.81; 10 2.54,3.81; 11 0,3.81; 12 -2.54,3.81; 13 -5.08,3.81; 14 -7.62,3.81
DIL08 = drill 0.813 pad 1.676 square: 1 -3.81,-3.81 | drill 0.813 pad 1.676 octagon: 2 -1.27,-3.81; 3 1.27,-3.81; 4 3.81,-3.81; 5 3.81,3.81; 6 1.27,3.81; 7 -1.27,3.81; 8 -3.81,3.81
DIL20 = drill 0.813 long: 1 -11.43,-3.81; 2 -8.89,-3.81; 3 -6.35,-3.81; 4 -3.81,-3.81; 5 -1.27,-3.81; 6 1.27,-3.81; 7 3.81,-3.81; 8 6.35,-3.81; 9 8.89,-3.81; 10 11.43,-3.81; 11 11.43,3.81; 12 8.89,3.81; 13 6.35,3.81; 14 3.81,3.81; 15 1.27,3.81; 16 -1.27,3.81; 17 -3.81,3.81; 18 -6.35,3.81; 19 -8.89,3.81; 20 -11.43,3.81
DIL28-3 = drill 0.813 long: 1 -16.51,-3.81; 2 -13.97,-3.81; 3 -11.43,-3.81; 4 -8.89,-3.81; 5 -6.35,-3.81; 6 -3.81,-3.81; 7 -1.27,-3.81; 8 1.27,-3.81; 9 3.81,-3.81; 10 6.35,-3.81; 11 8.89,-3.81; 12 11.43,-3.81; 13 13.97,-3.81; 14 16.51,-3.81; 15 16.51,3.81; 16 13.97,3.81; 17 11.43,3.81; 18 8.89,3.81; 19 6.35,3.81; 20 3.81,3.81; 21 1.27,3.81; 22 -1.27,3.81; 23 -3.81,3.81; 24 -6.35,3.81; 25 -8.89,3.81; 26 -11.43,3.81; 27 -13.97,3.81; 28 -16.51,3.81
1X02 = drill 1.016 pad 1.88: 1 0,0; 2 2.54,0
G5V1 = drill 0.813 pad 1.778 octagon: 1 -5.08,-2.54; 2 -2.54,-2.54; 5 5.08,-2.54; 6 5.08,2.54; 9 -2.54,2.54; 10 -5.08,2.54
LED3MM = drill 0.813 pad 1.778 octagon: A -1.27,0; K 1.27,0
SOT54E = drill 0.813 octagon: D -1.27,0; G 0,1.905; S 1.27,0
0204/7 = drill 0.813 pad 1.93 octagon: 1 -3.81,0; 2 3.81,0
0204/2V = drill 0.813 pad 1.93 octagon: 1 -1.27,0; 2 1.27,0
B3F-10XX = drill 1.016 pad 1.93 octagon: 1 -3.251,2.261; 2 3.251,2.261; 3 -3.251,-2.261; 4 3.251,-2.261
SJ_2S-NO = smd 0.635 x 1.27: 1 -0.45,0; 2 0.45,0
ML6 = drill 0.914 pad 1.778 square: 1 -2.54,-1.27 | drill 0.914 pad 1.778 octagon: 2 -2.54,1.27; 3 0,-1.27; 4 0,1.27; 5 2.54,-1.27; 6 2.54,1.27
ML14 = drill 0.914 pad 1.778 square: 1 -7.62,-1.27 | drill 0.914 pad 1.778 octagon: 2 -7.62,1.27; 3 -5.08,-1.27; 4 -5.08,1.27; 5 -2.54,-1.27; 6 -2.54,1.27; 7 0,-1.27; 8 0,1.27; 9 2.54,-1.27; 10 2.54,1.27; 11 5.08,-1.27; 12 5.08,1.27; 13 7.62,-1.27; 14 7.62,1.27
CON-HARTING-ML_ML08 = drill 0.914 pad 1.778 square: 1 -5.08,-1.27 | drill 0.914 pad 1.778 octagon: 2 -5.08,1.27; 3 -2.54,-1.27; 4 -2.54,1.27; 5 0,-1.27; 6 0,1.27; 7 2.54,-1.27; 8 2.54,1.27
MUX-SIGNAL = drill 0.8 pad 1.524 square: 1 -1,-1 | drill 0.8 pad 1.524 octagon: 2 -1,1; 3 1,-1; 4 1,1
TO92 = drill 0.813 octagon: 1 1.27,0; 2 0,1.905; 3 -1.27,0
ARDUINOR3 = drill 1 pad 1.676 octagon: 3V 35.56,2.54; 5V 38.1,2.54; A0 50.8,2.54; A1 53.34,2.54; A2 55.88,2.54; A3 58.42,2.54; A4 60.96,2.54; A5 63.5,2.54; AREF 23.876,50.8; D0 63.5,50.8; D1 60.96,50.8; D2 58.42,50.8; D3 55.88,50.8; D4 53.34,50.8; D5 50.8,50.8; D6 48.26,50.8; D7 45.72,50.8; D8 41.656,50.8; D9 39.116,50.8; D10 36.576,50.8; D11 34.036,50.8; D12 31.496,50.8; D13 28.956,50.8; GND 26.416,50.8; GND1 43.18,2.54; GND2 40.64,2.54; IOREF 30.48,2.54; RESERVED 27.94,2.54; RESET 33.02,2.54; SCL 18.796,50.8; SDA 21.336,50.8; VIN 45.72,2.54

### Placement (x,y rotation side)
1  65.34,5.08 0 top
2  69.15,2.54 0 top
3  84.39,2.54 0 top
4  88.2,5.08 0 top
5  88.2,12.7 0 top
6  84.39,15.24 0 top
7  69.15,15.24 0 top
8  65.34,12.7 0 top
B1  65.34,40.01 0 top
B2  69.15,40.01 0 top
B3  72.96,40.01 0 top
B4  76.77,40.01 0 top
B5  80.58,40.01 0 top
B6  84.39,40.01 0 top
B7  88.2,40.01 0 top
B8  88.2,60.33 0 top
B9  84.39,60.33 0 top
B10  80.58,60.33 0 top
B11  76.77,60.33 0 top
B12  72.96,60.33 0 top
B13  69.15,60.33 0 top
B14  65.34,60.33 0 top
C1  49.53,23.5 180 top
C2  55.88,12.06 90 top
C3  53.34,12.06 270 top
C4  50.8,12.06 90 top
C8  19,57.73 90 top
CAN1  39.37,32.38 90 top
CON1  13.97,24.77 270 top
CON2  26.67,9.53 90 top
CON3  30.48,19.68 270 top
CON4  43.18,12.06 90 top
CON5  69.15,43.81 0 top
CON6  80.58,33.79 180 top
CON7  72.96,21.09 0 top
CON8  84.39,56.52 180 top
CON9  72.96,2.54 0 top
CON10  80.58,15.24 180 top
CON11  60.66,77.42 180 top
CON12  37.8,65.99 0 top
D1  55.88,18.41 90 top
D2  53.34,18.41 90 top
D3  50.8,18.41 90 top
D4  48.26,18.41 90 top
D5  35.56,32.38 180 top
D6  54.61,47.62 180 top
D7  11.43,53.98 0 top
D8  53.3,21.18 0 top
DJ1  53.34,55.24 90 top
DJ2  41.91,55.24 90 top
E1  65.41,33.66 0 top
E2  69.22,33.66 0 top
E3  84.45,33.66 0 top
E4  88.27,33.66 0 top
E5  65.41,20.95 180 top
E6  69.22,20.95 180 top
E7  84.45,20.95 180 top
E8  88.27,20.95 180 top
IC1  20.32,17.14 270 top
IC2  36.83,15.88 270 top
IC3  76.77,27.44 180 top
IC4  76.77,50.16 0 top
IC5  76.77,8.89 0 top
IC6  49.23,71.7 0 top
IC7  18.02,71.75 0 top
J1  11.43,2.54 0 top
K1  39.37,26.04 180 top
K2  53.34,40.01 270 top
K3  45.72,40.01 270 top
K4  38.1,40.01 270 top
K5  39.37,50.16 180 top
K6  5.08,47.62 270 top
L1  64.77,76.52 270 top
L2  69.53,76.52 270 top
L3  83.82,71.75 270 top
L4  88.58,71.75 270 top
L5  88.58,66.99 270 top
L6  83.82,66.99 270 top
L7  79.06,76.52 270 top
L8  74.3,76.52 270 top
L9  83.82,76.52 270 top
L10  88.58,76.52 270 top
L11  79.06,71.75 270 top
L12  74.3,71.75 270 top
LED1  6.35,13.34 0 top
LED2  6.35,18.41 0 top
LED3  6.35,23.5 0 top
LED4  6.35,28.57 0 top
LED5  6.35,33.66 0 top
LED6  6.35,38.73 0 top
LED7  30.49,26.01 180 top
LED8  57.83,60.27 180 top
LED9  6.38,59.38 180 top
Q1  47.62,28.57 270 top
Q2  52.07,28.57 270 top
Q3  10.79,50.16 270 top
Q4  37.94,55.56 0 top
Q5  37.94,59.85 0 top
Q6  49.53,55.88 0 top
R1  22.23,3.81 0 top
R2  22.23,6.35 0 top
R3  46.99,9.53 180 top
R4  6.35,9.53 180 top
R5  6.35,5.71 180 top
R6  6.35,2.54 180 top
R7  13.97,6.35 180 top
R8  39.37,9.53 180 top
R9  45.72,18.41 90 top
R10  30.48,22.86 180 top
R11  48.9,50.16 180 top
R12  54.61,50.16 180 top
R13  55.88,27.3 270 top
R14  48.9,47.62 180 top
R15  48.9,52.7 180 top
R16  25.36,27.23 180 top
R17  54.61,23.5 0 top
R18  54.61,52.7 0 top
R19  10.79,46.35 180 top
R20  6,55.37 0 top
R21  34.13,56.67 270 top
R22  13.81,57.78 270 top
R23  45.09,56.36 270 top
S1  31.75,4.45 0 top
S2  41.91,4.45 0 top
S3  52.07,4.45 0 top
SJ1  34.92,25.4 0 bottom
SJ2  52.7,36.2 270 bottom
SJ3  43.18,36.83 270 bottom
SJ4  38.73,36.2 270 bottom
SJ5  34.92,50.16 0 bottom
SJ6  5.08,45.09 270 bottom
SJ7  46.48,22.36 270 bottom
SJ8  24.13,59.05 0 bottom
SV1  27.94,54.61 270 top
SV2  18.41,41.27 270 top
SV3  27.94,36.2 270 top
SV4  76.77,50.16 0 top
SV5  76.77,27.44 0 top
SV6  78.04,8.89 0 top
SV7  49.23,71.7 180 top
SV8  18.41,71.75 0 top
SV9  66.99,67.31 0 top
T1  47.62,13.34 90 top
U1  7.62,70.48 270 top

### Tracks (layer width: path | path; a pad name or v marks a point on that pad's centre or on a via)
+5V
  Top 0.152: D6.C 55.88,48.48 57.07,49.67 57.07,53.2 55.88,54.39 55.88,57.15 58.99,60.27 LED8.A
  Top 0.406: 33.97,34.29 34.44,34.29 35.04,33.68 35.53,33.68 D5.C
  Top 0.813: D5.C CAN1.1 | U1.5V 12.7,32.38 | 12.7,32.38 13.97,33.66 15.1,33.66 16.85,31.9 29.5,31.9 31.89,34.29 33.97,34.29 | 12.7,32.38 12.7,42.55 10.41,44.83 8.89,44.83 7.62,46.1 K6.9 | K2.9 52.85,42.55 51.4,41.1 50.2,41.1 48.75,42.55 K3.9 45.23,42.55 43.78,41.1 42.58,41.1 41.13,42.55 K4.9
  Bottom 0.406: K2.9 55.24,43.18 55.24,43.96 54.63,44.57 54.63,45.6 55.88,46.84 D6.C | D5.C 34.27,29.82 33.77,29.82 31.76,27.8 LED7.A | SJ8.2 19.05,59.05 C8.1
  Bottom 0.61: K6.9 10.16,52.7
  Bottom 0.813: CAN1.1 39.37,24.77 40.64,23.5 K1.9 | K5.9 40.64,47.62 39.19,46.18 39.19,42.55 | 10.16,52.7 D7.C 10.16,59.37 | D5.C 37.54,33.1 37.54,37.19 39.19,38.84 39.19,42.55 | K4.9 39.19,42.55 | 10.16,59.37 7.67,59.37 LED9.A | C8.1 17.04,60.96 12.9,60.96 11.3,59.37 10.16,59.37
  pour Top: 1.27,62.23 60.96,62.23 60.96,1.27 1.27,1.27
A0
  Top 0.152: S3.2 S3.1 47.12,5 19.76,5 R2.1
  Bottom 0.152: R3.1 48.82,8.97 S3.1 | U1.A0 12.7,17.14 12.7,9.14 13.49,8.36 16.41,8.36 R2.1 R1.1
A1  (via drill 0.35)
  Top 0.152: U1.A1 11.43,15.88 11.43,14.61 12.7,13.34 27.56,13.34 30,15.77 35.36,15.77 38,18.41 v44.45,18.41
  Bottom 0.152: v44.45,18.41 44.45,20.95 43.33,22.07 43.33,31.27 CAN1.3
A2
  Bottom 0.152: U1.A2 10.16,13.57 9.09,12.51 9.09,11 R4.1
A3
  Bottom 0.152: U1.A3 10.16,11.03 9.09,9.97 9.09,5.92 8.89,5.71 R5.1
A4
  Bottom 0.152: U1.A4 10.16,8.49 11.23,7.43 11.23,6.15 R6.1
AD_12V
  Top 0.152: R8.2 33.93,7.9 15.24,7.9 | 15.24,7.9 11.07,7.9 U1.A5 | R7.1 15.24,7.9
CLK_EX
  Top 0.152: K3.1 42.22,45.09 41.1,46.2 35.1,46.2 34.44,45.55 34.44,43.97 SV3.4 28.25,38.73 27.13,39.85 26.21,39.85 22.55,36.2 SV2.12
CLK_TY
  Top 0.152: IC1.9 CON2.2 28.83,12.06 30,13.23 34.19,13.23 38.1,17.14 IC2.7 CON4.3 | K3.6 K3.5
  Bottom 0.152: CON4.3 43.18,18.03 42.01,19.2 42.01,20.17 43.03,21.18 43.03,24.92 40.64,27.3 40.64,32.7 42.72,34.77 43.03,34.77 K3.5 SJ3.2
CLK_U
  Bottom 0.152: U1.D13 53.57,36.68 53.57,35.33 52.07,33.83 CAN1.6 52.07,31.1 52.96,30.21 52.96,29.48 52.44,28.96 50.42,28.96 48.11,31.27 48.11,32.85 46.99,33.97 46.99,43.38 47.27,43.66 48.85,43.66 49.68,44.5 49.68,45.55 50.16,46.03 R14.1
CLKI_EX
  Top 0.152: SV2.3 16.03,45.24 16.03,35.41 16.51,34.92 22.02,34.92 24.71,37.62 26.67,37.62 SV3.3 27.63,38.73 28.75,37.62 29.67,37.62 34.44,42.39 34.44,43.01 35.4,43.97 48.72,43.97 49.84,45.09 K2.1
CLKI_TY  (via drill 0.35)
  Top 0.152: IC1.2 CON1.2 12.7,20.95 12.7,16.76 13.59,15.88 29.21,15.88 CON3.2 IC2.2 | K2.6 K2.5 46.99,38.73 v35.56,38.73
  Bottom 0.152: SJ2.2 51.88,34.92 K2.5 | v35.56,38.73 31.75,34.92 31.75,31.11 29.84,29.21 29.84,27.32 30.48,26.68 30.48,21.89 29.31,20.72 29.31,18.31 CON3.2
CLKI_U
  Bottom 0.152: U1.D10 57,35.33 57,39.68 57.78,40.46 58.86,40.46 59.49,41.09 59.49,41.97 58.86,42.6 57.41,42.6 57,43.01 57,49.05 R12.1
CP_GND
  Top 0.152: R9.2 47.14,18.26 47.14,16.68 47.95,15.88 57.15,15.88 57.35,16.08 57.35,17.59 58.42,18.65 U1.D5
CP_PWR
  Bottom 0.152: U1.D4 D1.A
GND  (via drill 0.35)
  Top 0.152: Q6.S 52.17,57.25 52.17,58.27 53.34,59.44 DJ1.3
  Top 0.406: S3.3 S2.4 S2.3 S1.4 S1.3 17.78,2.18 | 16.08,2.18 15.12,1.22 11.43,1.22 J1.1 11.43,3.17 12.7,4.45 R7.2 | 22.86,24.77 IC1.14 CON2.7 | R19.2 10.79,47.62 Q3.S 13.97,48.9 15.24,47.62 18.41,47.62 SV2.2 | R13.2 53.34,26.04 Q2.S Q1.S | SV3.7 27.45,33.66 28.69,34.9 30.48,34.9 | 41.88,36.17 41.88,33.68 41.91,33.66 CAN1.2 | U1.GND 57.12,42.77 57.12,42.03 55.65,40.55
  Top 0.61: Q5.S 38.42,60.64 37.46,60.64 37.13,60.97 36.21,60.97 36.2,60.96 33.02,60.96 SV1.2
  Top 0.813: v44.45,40.01 44.78,39.67 54.77,39.67 55.65,40.55 | S3.4 S3.3 17.78,2.18 16.08,2.18 | CON3.4 IC2.4 | 41.88,36.17 40.59,37.47 33.02,37.47 33.02,37.44 30.48,34.9 | CON2.7 22.86,24.77 20.32,27.3 U1.GND1
  Bottom 0.152: 55.88,22.48 R17.2
  Bottom 0.406: CON2.7 26.67,24.06 25.32,22.71 25.32,7.51 24.71,6.9 24.71,3.26 25.49,2.49 28.19,2.49 S1.3 | 52.07,8.26 52.07,11.57 49.55,14.09 49.55,14.61 | T1.1 49.55,14.61 | R17.2 R13.2 | Q2.S 50.8,26.04 C1.2 49.55,22.25 49.55,14.61 | SV1.5 26.67,52.85 27.96,54.15 27.96,55.13 29.21,56.37 SV1.2 | CAN1.2 42.69,32.38 42.69,32.39 44.45,34.15 | Q1.S 46.99,27.3 45.72,28.57 45.72,32.38 45.7,32.41 45.7,32.9 44.97,33.63 44.65,33.63 44.45,33.83 | D8.A 55.88,22.48 | DJ1.3 50.02,60.33 48.78,61.57 45.2,61.57 43.96,60.33 DJ2.3
  Bottom 0.61: Q5.S 39.37,59.85 | 39.37,59.85 41.43,59.85 DJ2.3 | Q4.S 39.37,55.72 39.37,59.85
  Bottom 0.813: 24.13,48.9 24.13,49.53 SV1.5 | 24.13,48.9 SV2.2 19.68,55.77 C8.2 | v44.45,40.01 44.45,35.7 44.63,35.52 44.63,34.33 44.45,34.15 44.45,33.83 | IC2.4 33.02,4.17 S1.4 | S3.3 52.07,5.44 52.07,8.26 | 24.13,48.9 24.13,36.69 26.67,34.15 SV3.7 22.57,29.55 22.57,26.6 24.13,25.04 IC1.14 | U1.GND1 U1.GND2
  pour Bottom: 1.27,62.23 60.96,62.23 60.96,1.27 1.27,1.27
MISO_EX
  Top 0.152: SV2.14 25.09,33.66 26.21,34.77 27.79,34.77 SV3.6
  Bottom 0.152: SV3.6 29.21,37.15 30.33,38.27 30.33,43.66 31.75,45.09 K4.1
MISO_TY
  Top 0.152: IC1.8 CON2.1 32.66,9.53 35.51,12.37 38.41,12.37 IC2.6 CON4.2 | K4.6 K4.5
  Bottom 0.152: SJ4.2 39.55,34.92 K4.6 40.49,34.77 40.18,34.77 38.25,32.85 38.25,18.02 40.64,15.64 IC2.6
MISO_U
  Top 0.152: CAN1.4 48.26,33.66 57.05,33.66 57.05,36.59 58.42,37.96 U1.D12
  Bottom 0.152: R11.1 50.16,49.31 48.97,48.12 48.97,47.13 49.38,46.72 49.38,44.62 48.72,43.97 47.14,43.97 45.72,42.55 45.72,33.66 CAN1.4
MOSI_EX
  Top 0.152: SV2.13 18.26,32.54 28.09,32.54 SV3.8
  Bottom 0.152: SV3.8 29.21,34.61 30.33,35.73 30.33,36.68 35.08,41.43 36.02,41.43 36.98,42.39 36.98,45.7 43.99,52.7 K5.1
MOSI_TY  (via drill 0.35)
  Top 0.152: CON1.7 IC1.7 22.62,9.53 23.79,8.36 27.7,8.36 27.84,8.49 27.84,8.79 28.27,9.22 32.79,9.22 35.6,12.03 40.6,12.03 IC2.5 CON4.1 | v17.14,53.34 17.78,52.7 21.59,52.7 24.13,50.16 31.75,50.16 32.07,50.48 K5.5
  Bottom 0.152: CON1.7 13.97,10.41 15.14,11.58 15.14,51.33 v17.14,53.34 | K5.6 34.48,47.81 SJ5.2 34.48,52.52 K5.5
MOSI_U
  Top 0.152: CAN1.5 50.8,31.11 55.88,31.11 57.35,32.59 57.35,34.35 58.42,35.42 U1.D11
  Bottom 0.152: R15.1 50.16,51.85 51.36,50.66 51.36,46.11 51.92,45.55 51.92,44.62 51.26,43.97 50.64,43.97 49.38,42.7 49.38,32.54 CAN1.5
N$1
  Bottom 0.152: C2.2 D1.C D2.A
N$2
  Bottom 0.152: C3.2 53.34,13.02 52.22,14.14 52.22,15.07 53.34,16.19 D2.C D3.A
N$3
  Top 0.152: D3.C D4.A
  Bottom 0.152: C4.2 D3.C
N$4
  Bottom 0.305: CON9.4 IC5.4 | IC5.4 SV6.7 | IC5.4 4.1
N$5
  Top 0.305: 3.1 83.12,2.54 81.85,3.81 79.31,3.81 CON9.3
  Bottom 0.305: SV6.5 IC5.3 CON9.3
N$6
  Top 0.152: CON2.3 IC1.10
  Bottom 0.152: SV2.10 19.68,37.78 18.57,36.66 18.57,15.09 19.05,14.61 IC1.10
N$7
  Bottom 0.152: R9.1 T1.2
N$8
  Top 0.152: CAN1.8 44.55,59.16 39.78,59.16 39.58,58.96 36.3,58.96 36.11,59.16 32.96,59.16 29.21,55.4 SV1.4
N$9  (via drill 0.35)
  Top 0.152: R8.1 45.72,12.06 T1.3 | D4.C 48.26,18.1 47.14,19.22 v47.14,20.95 40.84,20.95 40.64,21.16 30.91,21.16 R10.2
  Bottom 0.152: D4.C 46.74,15.62 46.74,12.95 T1.3 | SJ7.2 47.14,21.25 v47.14,20.95
N$10
  Top 0.152: SV1.3 27.63,54.61 28.75,53.49 29.67,53.49 32.8,56.62 37.53,56.62 37.57,56.58 38.31,56.58 38.35,56.62 44.41,56.62 44.59,56.43 46.27,56.43 48.26,58.42 CAN1.9
N$11
  Top 0.152: CON2.4 IC1.11 | R23.2 43.95,55.09 42.94,54.08 37.57,54.08 30.33,46.84 30.33,40.81 29.67,40.16 20.8,40.16 SV2.8
  Bottom 0.152: IC1.11 22.23,17.14 20.47,18.9 20.47,32.86 20.8,33.19 20.8,40.16 SV2.8
N$12
  Top 0.152: CON2.5 IC1.12
  Bottom 0.152: IC1.12 22.86,19.68 20.95,21.59 20.95,31.6 23.01,33.66 23.01,42.39 21.59,43.81 SV2.6 18.26,45.24 18.26,53.08 17.4,53.95 16.38,53.95 R22.2
N$13  (via drill 0.35)
  Top 0.152: v36.83,50.16 41.91,50.16 K5.10 45.8,48.97 45.8,50.66 47.62,52.49 R15.2
  Bottom 0.152: v36.83,50.16 SJ5.1
N$14  (via drill 0.35)
  Top 0.152: CON2.6 IC1.13 | v25.4,46.99 20.32,46.99 SV2.4
  Bottom 0.152: SV2.4 21.59,46.35 22.86,45.09 22.86,42.98 23.32,42.52 23.32,33.53 21.26,31.47 21.26,23.82 22.86,22.23 IC1.13 | R21.2 25.72,46.99 v25.4,46.99
N$15
  Bottom 0.152: SJ4.1 41.76,39.67 41.76,43.01 40.64,44.13 K4.10 40.95,45.09 43.33,47.47 43.33,48.09 45.41,50.16 R11.2
N$16
  Top 0.305: 2.1 70.65,2.54 71.89,3.79 74.03,3.79 75.27,2.54 CON9.2
  Bottom 0.305: CON9.2 IC5.2 SV6.3
N$17
  Bottom 0.152: 46.35,45.09 46.35,46.35 R14.2 | K3.10 46.35,45.09 | SJ3.1 43.18,40.96 44.3,42.08 44.3,43.03 46.35,45.09
N$18
  Bottom 0.305: SV6.1 IC5.1 | IC5.1 1.1 | IC5.1 CON9.1
N$19
  Bottom 0.152: K2.2 51.98,43.73 51.98,44.25 52.22,44.5 52.22,45.67 51.84,46.05 51.84,56.29 DJ1.2
N$20  (via drill 0.35)
  Top 0.152: Q1.D 41.91,29.84 | 41.91,29.84 36.83,29.84 D5.A 32.7,30.8 28.48,30.8 28.19,31.09 27.69,31.09 27.4,30.8 v26.67,30.8 | K1.2 41.91,29.84
  Bottom 0.152: v26.67,30.8 24.09,28.22 R16.2
N$21
  Bottom 0.152: K3.2 46.05,45.41 46.05,47.74 47.13,48.82 48.12,48.82 48.97,49.67 48.97,53.05 47.2,54.82 47.04,54.82 45.58,56.28 43.41,56.28 DJ2.2
N$22  (via drill 0.35)
  Top 0.152: R10.1 33.34,22.86 33.83,22.38 34.75,22.38 35.41,23.03 35.41,23.98 v36.83,25.4 42.55,25.4 K1.10 46.38,21.56 47.41,21.56 47.79,21.18 D8.C
  Bottom 0.152: SJ1.1 v36.83,25.4
N$23
  Top 0.152: CON1.6 IC1.6
  Bottom 0.152: IC1.6 17.78,13.34 17.78,15.44 17.88,15.55 17.88,25.82 17.78,25.93 17.78,31.9 18.26,32.38 18.26,34.12 17.14,35.24 SV2.11
N$24  (via drill 0.35)
  Top 0.152: v53.34,43.81 54.61,45.09 K2.10
  Bottom 0.152: SJ2.1 52.7,43.18 v53.34,43.81 53.34,46.04 54.46,47.16 54.46,48.09 53.34,49.21 R12.2
N$25
  Top 0.152: K6.2 3.81,51.44 Q3.D
  Bottom 0.152: Q3.D 12.7,53.34 D7.A | R20.2 2.54,50.63 K6.2
N$26  (via drill 0.35)
  Top 0.152: K4.2 39.06,39.04 47.12,39.04 47.42,38.73 v50.8,38.73
  Bottom 0.152: Q2.D 50.8,31.11 50.8,33.34 49.68,34.46 49.68,35.39 52.4,38.11 52.4,38.73 | K4.2 35.56,43.5 36.68,44.62 36.68,46.35 41.91,51.59 K5.2 DJ2.1 | v50.8,38.73 52.4,38.73 | 52.4,47.62 52.4,49.42 52.15,49.67 52.15,53.98 53.34,55.17 | D6.A 52.4,47.62 | 52.4,38.73 52.4,44.24 52.53,44.37 52.53,45.8 52.4,45.93 52.4,47.62 | 53.34,55.17 DJ1.1 | R18.2 53.42,55.17 53.34,55.17
N$27
  Top 0.152: CON1.5 IC1.5
  Bottom 0.152: SV2.9 15.88,37.47 15.88,27.4 17.58,25.7 17.58,15.67 IC1.5
N$28
  Top 0.152: R1.2 20.1,3.81 18.91,5 15.8,5 13.97,3.17 J1.2
N$29
  Bottom 0.305: CON10.1 IC5.5 | IC5.5 SV6.8 | IC5.5 5.1
N$30
  Top 0.152: CON1.3 IC1.3
  Bottom 0.152: IC1.3 15.44,20.75 15.44,42.11 SV2.5
N$31
  Top 0.305: 6.1 82.89,15.24 81.65,13.99 79.51,13.99 78.27,15.24 CON10.2
  Bottom 0.305: SV6.6 IC5.6 CON10.2
N$32
  Top 0.305: 7.1 70.42,15.24 71.69,13.97 74.23,13.97 CON10.3
  Bottom 0.305: CON10.3 IC5.7 SV6.4
N$33
  Top 0.152: S2.2 S2.1
  Bottom 0.152: S2.2 45.72,7.26 R3.2
N$34
  Top 0.152: R4.2 5.18,9.58 5.18,13.23 LED1.A 5.18,13.39 5.18,15.98 LED2.K 7.62,21.01 5.18,23.44 LED3.A
  Bottom 0.152: LED5.K 7.62,30.3 6.25,28.93 6.25,24.66 LED3.A
N$35
  Bottom 0.406: SV4.14 IC4.8 CON8.1 B8.1
N$36
  Top 0.152: LED7.K 27.99,27.23 R16.1
N$37
  Top 0.152: R18.1 55.58,54.94 55.58,55.88 55.58,55.91 55.58,57.28 56.55,58.26 LED8.K
N$38
  Bottom 0.152: R20.1 5.11,55.75 LED9.K
N$39
  Bottom 0.152: SJ7.1 47.17,23.5 C1.1
N$40
  Bottom 0.406: B9.1 81.85,57.78 CON8.2 IC4.9 SV4.12
N$41
  Bottom 0.406: B10.1 79.31,59.05 CON8.3 IC4.10 SV4.10
N$42
  Top 0.152: LED3.K 7.62,26.04 LED4.A 5.18,28.63 5.18,33.66 LED5.A
  Bottom 0.152: LED6.K 7.62,36.09 5.18,33.66 LED5.A | R5.2 5.18,5.77 5.18,7.9 6.4,9.12 6.4,10.49 8.84,12.93 8.84,22.23 7.62,23.44 LED3.K
N$43
  Bottom 0.406: B11.1 CON8.4 IC4.11 SV4.8
N$44
  Top 0.152: LED4.K 7.62,31.98 6.25,33.35 6.25,37.62 5.18,38.68 LED6.A | R6.2 5.18,2.59 5.18,4.09 6.4,5.31 6.4,12.01 7.62,13.23 LED1.K
  Bottom 0.152: LED1.K 7.62,15.98 5.18,18.41 | LED4.K 7.62,25.12 6.25,23.75 6.25,19.48 5.18,18.41 | 5.18,18.41 LED2.A
N$45
  Top 0.406: SV1.6 28.57,52.07 27.28,53.37 26.15,53.37 25.43,54.09 25.43,55.91 SV1.1
  Bottom 0.406: SJ8.1 26.48,57.15 SV1.1
N$46
  Bottom 0.406: B12.1 74.23,59.05 CON8.5 IC4.12 SV4.6
N$47
  Bottom 0.406: B13.1 71.69,57.78 CON8.6 IC4.13 SV4.4
N$48
  Top 0.152: CON3.3 IC2.3
  Bottom 0.152: SV3.5 26.67,35.24 27.79,34.12 27.79,31.82 27.33,31.37 27.33,28.22 27.84,27.71 27.84,17.14 30.38,14.61 CON3.3
N$49
  Bottom 0.406: B14.1 CON8.7 IC4.14 SV4.2
N$50
  Bottom 0.406: SV4.13 IC4.7 CON5.7 B7.1
N$51
  Bottom 0.406: B6.1 81.85,42.55 CON5.6 IC4.6 SV4.11
N$52
  Bottom 0.406: SV4.9 IC4.5 CON5.5 79.31,41.27 B5.1
N$53
  Bottom 0.406: B4.1 CON5.4 IC4.4 SV4.7
N$54
  Bottom 0.406: SV4.5 IC4.3 CON5.3 74.23,41.27 B3.1
N$55
  Bottom 0.406: B2.1 71.69,42.55 CON5.2 IC4.2 SV4.3
N$56
  Bottom 0.406: B1.1 CON5.1 IC4.1 SV4.1
N$57
  Bottom 0.305: CON10.4 IC5.8 | IC5.8 SV6.2 | 8.1 IC5.8
N$58
  Top 0.152: 80.53,23.53 IC3.8 | 80.53,21.09 CON7.4 | 80.53,22.55 85.04,22.55 86.56,21.03 88.24,21.03 E8.1
  Top 0.406: 80.53,21.09 80.53,22.55 80.53,23.53 | IC3.8 80.58,26.66 79.8,27.44 70.42,27.44 SV5.1
N$59
  Top 0.152: 72.91,31.3 IC3.4 | 72.91,33.74 CON6.4 73,33.83 74.37,35.2 85.04,35.2 86.56,33.68 88.24,33.68 E4.1
  Top 0.406: 72.91,33.74 72.91,31.3 | SV5.2 70.42,29.98 71.69,29.98 IC3.4
N$60
  Top 0.152: 78.09,23.53 IC3.7 | 78.09,21.09 CON7.3 78.18,21.03 79.4,19.81 81.08,19.81 82.14,20.88 84.43,20.88 E7.1
  Top 0.406: 78.09,21.09 78.09,23.53 | IC3.7 79.31,24.9 SV5.9
N$61
  Top 0.152: E6.1 69.34,20.88 70.87,20.88 71.93,19.81 74.22,19.81 75.44,21.03 CON7.2
  Top 0.406: CON7.2 IC3.6 74.23,24.9 SV5.5
N$62
  Top 0.152: 72.91,23.53 IC3.5 | 72.91,21.09 CON7.1 | E5.1 65.53,21.03 67.06,21.03 70.56,24.54 71.63,24.54 71.77,24.67
  Top 0.406: 72.91,21.09 72.91,23.53 71.77,24.67 71.69,24.75 SV5.3
N$63
  Top 0.152: 80.53,31.3 IC3.1 | 80.53,33.74 CON6.1 80.62,33.68 84.43,33.68 E3.1
  Top 0.406: 80.53,33.74 80.53,31.3 | IC3.1 79.31,29.98 78.04,29.98 SV5.8
N$64
  Top 0.152: 78.09,31.3 IC3.2 | 78.09,33.74 CON6.2
  Top 0.406: 78.09,33.74 78.09,31.3 | SV5.6 75.5,29.98 76.77,29.98 IC3.2
  Bottom 0.152: E2.1 69.34,33.53 69.34,33.22 73.76,28.8 74.22,28.8 SV5.6
N$65
  Top 0.406: CON6.3 IC3.3 74.23,29.98 72.96,29.98 SV5.4
  Bottom 0.152: E1.1 65.53,33.53 66.9,33.53 71.63,28.8 SV5.4
N$66
  Top 0.152: SV7.7 49.25,73.11 50.32,73.11 51.38,74.18 52.45,74.18 52.76,73.88 53.52,73.88 53.82,74.18 54.74,74.18 55.65,73.27 55.65,72.05 56.11,71.59 57.33,71.59 60.53,68.39 60.53,67.93 IC6.10
  Bottom 0.406: IC6.10 CON12.10
N$67
  Top 0.152: S1.2 28.57,6.71 | 28.57,6.71 S1.1 | 28.57,6.71 28.22,6.35 R2.2
N$68
  Top 0.152: SV7.3 54.28,72.96 54.28,72.05 53.06,70.83 53.06,67.93 IC6.7
  Bottom 0.406: CON12.7 IC6.7
N$69
  Bottom 0.152: SV7.2 56.72,70.37 55.96,70.37 54.89,69.3 53.67,69.3 53.52,69.46 52.45,69.46 50.62,67.63 IC6.6
  Bottom 0.406: CON12.6 IC6.6
N$70
  Bottom 0.152: SV7.1 56.72,72.96 55.96,72.96 54.59,71.59 51.23,71.59 50.47,70.83 50.47,70.07 48.49,68.08 48.03,68.08 IC6.5
  Bottom 0.406: CON12.5 IC6.5
N$71
  Bottom 0.406: CON12.3 IC6.3 42.88,69.16 SV7.12
N$72
  Bottom 0.406: CON12.2 IC6.2 40.34,69.16 SV7.14
N$73
  Bottom 0.406: CON12.1 IC6.1 37.8,69.16 SV7.13
N$74
  Bottom 0.406: CON12.4 IC6.4
N$75
  Bottom 0.406: CON12.8 IC6.8
N$76
  Bottom 0.406: CON12.9 IC6.9
N$77
  Bottom 0.406: IC6.11 CON11.1
N$78
  Bottom 0.406: CON11.2 IC6.12
N$79
  Bottom 0.406: CON11.3 IC6.13
N$80
  Bottom 0.406: IC6.14 CON11.4
N$81
  Bottom 0.406: CON11.5 IC6.15
N$82
  Bottom 0.406: IC6.16 CON11.6
N$83
  Bottom 0.406: CON11.7 IC6.17
N$84
  Bottom 0.406: IC6.18 CON11.8
N$85
  Bottom 0.406: CON11.9 IC6.19
N$86
  Bottom 0.406: IC6.20 CON11.10
N$87
  Bottom 0.152: SV8.3 14.48,71.63 18.9,71.63 19.66,70.87 19.66,70.1 21.79,67.97 IC7.9
N$88
  Top 0.152: IC7.8 19.2,67.97 17.07,70.1 17.07,75.25 IC7.22
  Bottom 0.152: SV8.2 10.82,73 11.73,73 12.95,71.78 13.72,71.78 14.63,72.69 14.63,73.46 16.61,75.44 IC7.22
N$89
  Top 0.152: 11.58,70.41 10.82,70.41 SV8.1 11.58,70.41 | 11.58,70.41 12.8,71.63 13.87,71.63 14.48,71.02 14.48,70.1 16.61,67.97 IC7.7
N$90
  Bottom 0.152: IC7.1 1.52,67.82 2.13,67.82 3.66,66.29 17.07,66.29 18.29,67.51 18.29,70.41 SV8.7
N$91
  Top 0.152: IC7.17 29.41,75.44 29.41,73.91 26.06,70.56 SV8.13
N$92
  Top 0.152: IC7.18 26.82,75.44 26.82,73.91 26.06,73.15 SV8.14
N$93
  Top 0.152: 65.84,74.07 64.77,75.13 L1.K | 65.84,74.07 65.99,73.91 65.99,68.43 SV9.2 | 65.84,74.07 69.49,77.72 L2.A
  Bottom 0.152: 83.82,73 86.26,70.56 88.54,70.56 L4.K | 83.82,73 81.38,70.56 79.1,70.56 L11.K 78.94,70.56 76.81,70.56 74.37,73 L12.A 74.22,73.15 69.65,77.72 L2.A | 83.82,73 L3.A
N$94
  Top 0.152: SV8.12 24.23,73.76 24.23,75.44 IC7.19
N$95
  Top 0.152: L7.K 81.53,77.72 83.82,77.72 L9.A | L2.K 69.65,75.29 71.78,75.29 74.22,77.72 L8.A
  Bottom 0.152: 68.43,74.07 69.49,75.13 L2.K | 68.43,74.07 64.92,70.56 64.92,67.97 65.99,66.9 65.99,66.45 SV9.1 | 68.43,74.07 64.77,77.72 L1.A | L7.K 78.94,75.29 76.81,75.29 74.37,77.72 L8.A | L10.K 88.54,75.29 86.26,75.29 83.82,77.72 L9.A
N$96
  pour Bottom: 1.27,78.74 34.29,78.74 34.29,64.77 1.27,64.77
N$97
  Top 0.152: 86.56,75.13 85.04,75.13 | 85.04,75.13 83.82,75.13 L9.K | 86.56,75.13 88.54,73.15 L4.A | 86.56,75.13 88.54,77.11 88.54,77.72 L10.A | 85.04,75.13 85.04,71.78 83.82,70.56 L3.K
  Bottom 0.152: 81.84,68.43 68.12,68.43 SV9.4 | 81.84,68.43 83.82,70.41 L3.K | 81.84,68.43 83.82,66.45 | 83.82,66.45 85.5,68.12 88.54,68.12 L5.A | 83.82,66.45 L6.K
N$98
  Top 0.152: SV9.3 68.12,66.45 70.26,66.45 L12.K 74.37,70.56 74.37,71.48 75.44,72.54 75.44,75.13 | L5.K 88.54,65.84 86.11,65.84 83.82,68.12 L6.A 83.82,68.28 79.1,73 L11.A 78.94,73.15 76.96,75.13 | 76.96,75.13 75.44,75.13 | 75.44,75.13 74.37,75.13 L8.K | 76.96,75.13 78.94,77.11 78.94,77.72 L7.A
N$99
  pour Bottom: 36.83,78.74 60.96,78.74 60.96,64.77 36.83,64.77
N$100
  pour Bottom: 63.5,78.74 90.17,78.74 90.17,64.77 63.5,64.77
N$101
  pour Bottom: 63.5,62.23 90.17,62.23 90.17,38.1 63.5,38.1
N$102
  pour Bottom: 63.5,35.56 90.17,35.56 90.17,19.05 63.5,19.05
N$103
  pour Bottom: 63.5,16.51 90.17,16.51 90.17,1.27 63.5,1.27
N$104
  pour Top: 63.5,16.51 90.17,16.51 90.17,1.27 63.5,1.27
N$105
  pour Top: 63.5,19.05 90.17,19.05 90.17,35.56 63.5,35.56
N$106
  pour Top: 63.5,62.23 90.17,62.23 90.17,38.1 63.5,38.1
N$107
  pour Top: 63.5,78.74 90.17,78.74 90.17,64.77 63.5,64.77
N$108
  Bottom 0.152: Q4.D 34.29,57.94 R21.1
N$109
  Bottom 0.152: Q5.D 30.33,59.85 28.09,57.61 28.09,56.03 27.94,55.88 21.59,55.88 19.68,57.78 15.08,57.78 R22.1
N$110
  Bottom 0.152: Q6.D 46.83,55.88 R23.1
P1
  Top 0.152: C4.1 52.07,10.79 55.88,10.79 | U1.D2 57.15,10.79 55.88,10.79 | C2.1 55.88,10.79
P2
  Top 0.152: U1.D3 57.46,14.61 56.34,13.49 55.42,13.49 54.3,14.61 C3.1
PRG_R
  Top 0.152: R17.1 54.19,23.5 55.39,22.3 56.37,22.3 57.07,23 57.07,23.42 U1.D7
  Bottom 0.152: R17.1 53.98,24.13 Q2.G 58.24,32.84 58.86,32.84 59.49,33.47 59.49,39.43 59.38,39.54 59.38,40.55 59.79,40.96 59.79,42.1 58.99,42.9 57.54,42.9 57.3,43.13 57.3,52.97 56.52,53.76 56.52,56.26 53.82,58.95 52.86,58.95 51.69,57.78 Q6.G 46.62,57.78 45.45,58.95 41.43,58.95 40.1,57.63 40.1,55.19 39.58,54.67 38.84,54.67 38.32,55.19 38.32,57.09 Q4.G Q5.G
PWR_EX
  Top 0.152: K6.1 6.04,52.7 7.16,53.82 8.08,53.82 9.2,52.7 15.24,52.7 17.14,50.8 SV2.1 18.1,48.9 19.22,50.01 21.71,50.01 24.13,47.6 25.65,47.6 26.67,46.58 26.67,43.81 SV3.2
PWR_R  (via drill 0.35)
  Top 0.152: v14.3,30.18 14.94,29.54 33.68,29.54 33.83,29.69 35.13,29.69 37.97,26.85 41.53,26.85 43.61,24.77 56.52,24.77 58.42,26.67 U1.D8
  Bottom 0.152: v14.3,30.18 13.97,30.51 13.97,42.01 12.06,43.92 R19.1 12.7,46.99 Q3.G
PWR_TY
  Top 0.152: CON1.1 IC1.1 20.42,20.85 39.47,20.85 IC2.8 CON4.4 | K6.5 K6.6
  Bottom 0.152: SJ6.2 5.08,43.81 6.35,42.55 K6.6 8.65,42.55 9.72,43.61 11.51,43.61 12.64,42.48 12.64,30.98 13.97,29.65 CON1.1
PWR_U  (via drill 0.35)
  Top 0.152: U1.D9 56.82,29.77 53.91,29.77 53.02,28.88 50.48,28.88 49.9,29.46 48.53,29.46 46.22,27.15 38.1,27.15 35.26,30 33.7,30 33.55,29.85 16.51,29.85 15.24,31.11 v13.36,31.11
  Bottom 0.152: v13.36,31.11 13.36,42.19 11.56,43.99 9.98,43.99 8.44,45.53 SJ6.1 5.08,51.44 6.35,52.7 K6.10
RST_EX  (via drill 0.35)
  Top 0.152: K1.1 44.45,27.46 38.79,27.46 35.76,30.48 v27.94,30.48 | SV2.7 18.1,41.27 19.22,42.39 20.15,42.39 21.27,41.27 SV3.1
  Bottom 0.152: SV3.1 28.09,39.85 28.09,30.63 v27.94,30.48
RST_R
  Top 0.152: Q1.G 52.07,28.57 53.34,27.3 54.61,27.3 R13.1
  Bottom 0.152: R13.1 57.15,27.3 57.15,23.5 U1.D6
RST_TY
  Top 0.152: CON1.4 IC1.4 22.62,17.14 23.79,18.31 27.84,18.31 29.21,19.68 CON3.1 IC2.1
  Bottom 0.152: K1.5 34.48,28.39 SJ1.2 34.48,23.68 K1.6 33.02,22.23 IC2.1

### Text on the board
Top: +5V | Top
Bottom: GND | Bot
tPlace: ATTiny88 | by Hardi | by Hardi | + | by Hardi | + | 1 | Charliplexing / LED Test | + | + | 1 | + | + | 1 | 1 | 1 | by Hardi | Read | + | Prog. | + | Error | + | + | + | Servo Debug | Heart / Beat | + | by Hardi | Normal / Reset / Funkt. | + | Reset / as / IO Pin | by Hardi | Tiny UniProg | 30.10.19 | by Hardi | Restart Tiny | Chg Reset Pin
tNames: Pwr Rel. | Data Rel. | Data Rel.
bNames: CAN +5V | by Hardi | Close SJ1 - SJ6 / if used without / Relais | V 1.1 | Tiny UniProg | Opt. C